# EAGLE design main-robot (EAGLE 9.5.2)

## Sheet 1 of 6: POWER SUPPLY
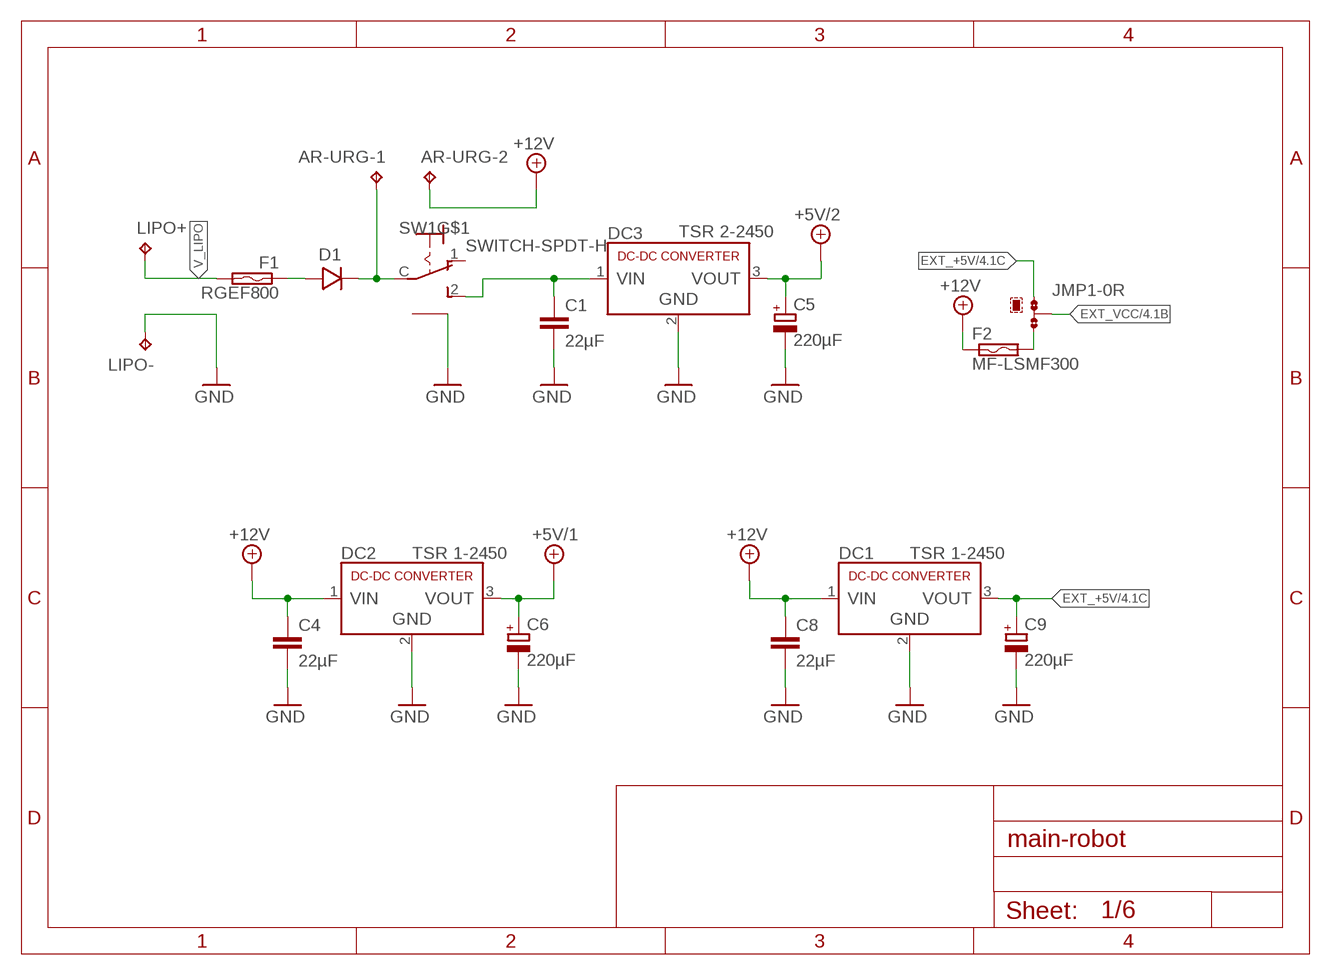
[diagram p0: schematic, sheet 1]

### Parts
AR-URG-1  TPPAD1-20Y  [P1-20Y]
AR-URG-2  TPPAD1-20Y  [P1-20Y]
C1  22µF  C-EUC0805  [C0805]
C4  22µF  C-EUC0805  [C0805]
C5  220µF  CPOL-EUD  [PANASONIC_D]
C6  220µF  CPOL-EUD  [PANASONIC_D]
C8  22µF  C-EUC0805  [C0805]
C9  220µF  CPOL-EUD  [PANASONIC_D]
D1  DIODE_S15P45  [TO-277A]
DC1  TSR 1-2450  TSR24501  [TSR1]
DC2  TSR 1-2450  TSR24501  [TSR1]
DC3  TSR 2-2450  TSR24502  [TSR2]
F1  RGEF800  [5MM]
F2  MF-LSMF300  [MF-LSMF300]
JMP1  0R-JUMPA  [A0R-JMP]
LIPO+  TPPAD1-20Y  [P1-20Y]
LIPO-  TPPAD1-20Y  [P1-20Y]
SW1  SWITCH-SPDT-H  [SWITCH_SPDT_H]

### Nets
+5V/1: C6.+ DC2.3(VOUT) ; also sheet 2,4,5
+5V/2: C5.+ DC3.3(VOUT) ; also sheet 3
+12V: AR-URG-2.TP C4.1 C8.1 DC1.1(VIN) DC2.1(VIN) F2.1 ; also sheet 4,5
EXT_+5V: C9.+ DC1.3(VOUT) JMP1.1 ; also sheet 4,6
EXT_VCC: JMP1.2 ; also sheet 4
GND: C1.2 C4.2 C5.- C6.- C8.2 C9.- DC1.2(GND) DC2.2(GND) DC3.2(GND) LIPO-.TP SW1.CASE1(GND) SW1.CASE2(GND) ; also sheet 2,3,4,5,6
N$1: C1.1 DC3.1(VIN) SW1.2
N$2: D1.+1(+) D1.+2(+) F1.P$1
N$11: AR-URG-1.TP D1.- SW1.C
N$15: F2.2 JMP1.3
V_LIPO: F1.P$2 LIPO+.TP
Unconnected: SW1.1

## Sheet 2 of 6: TEENSY
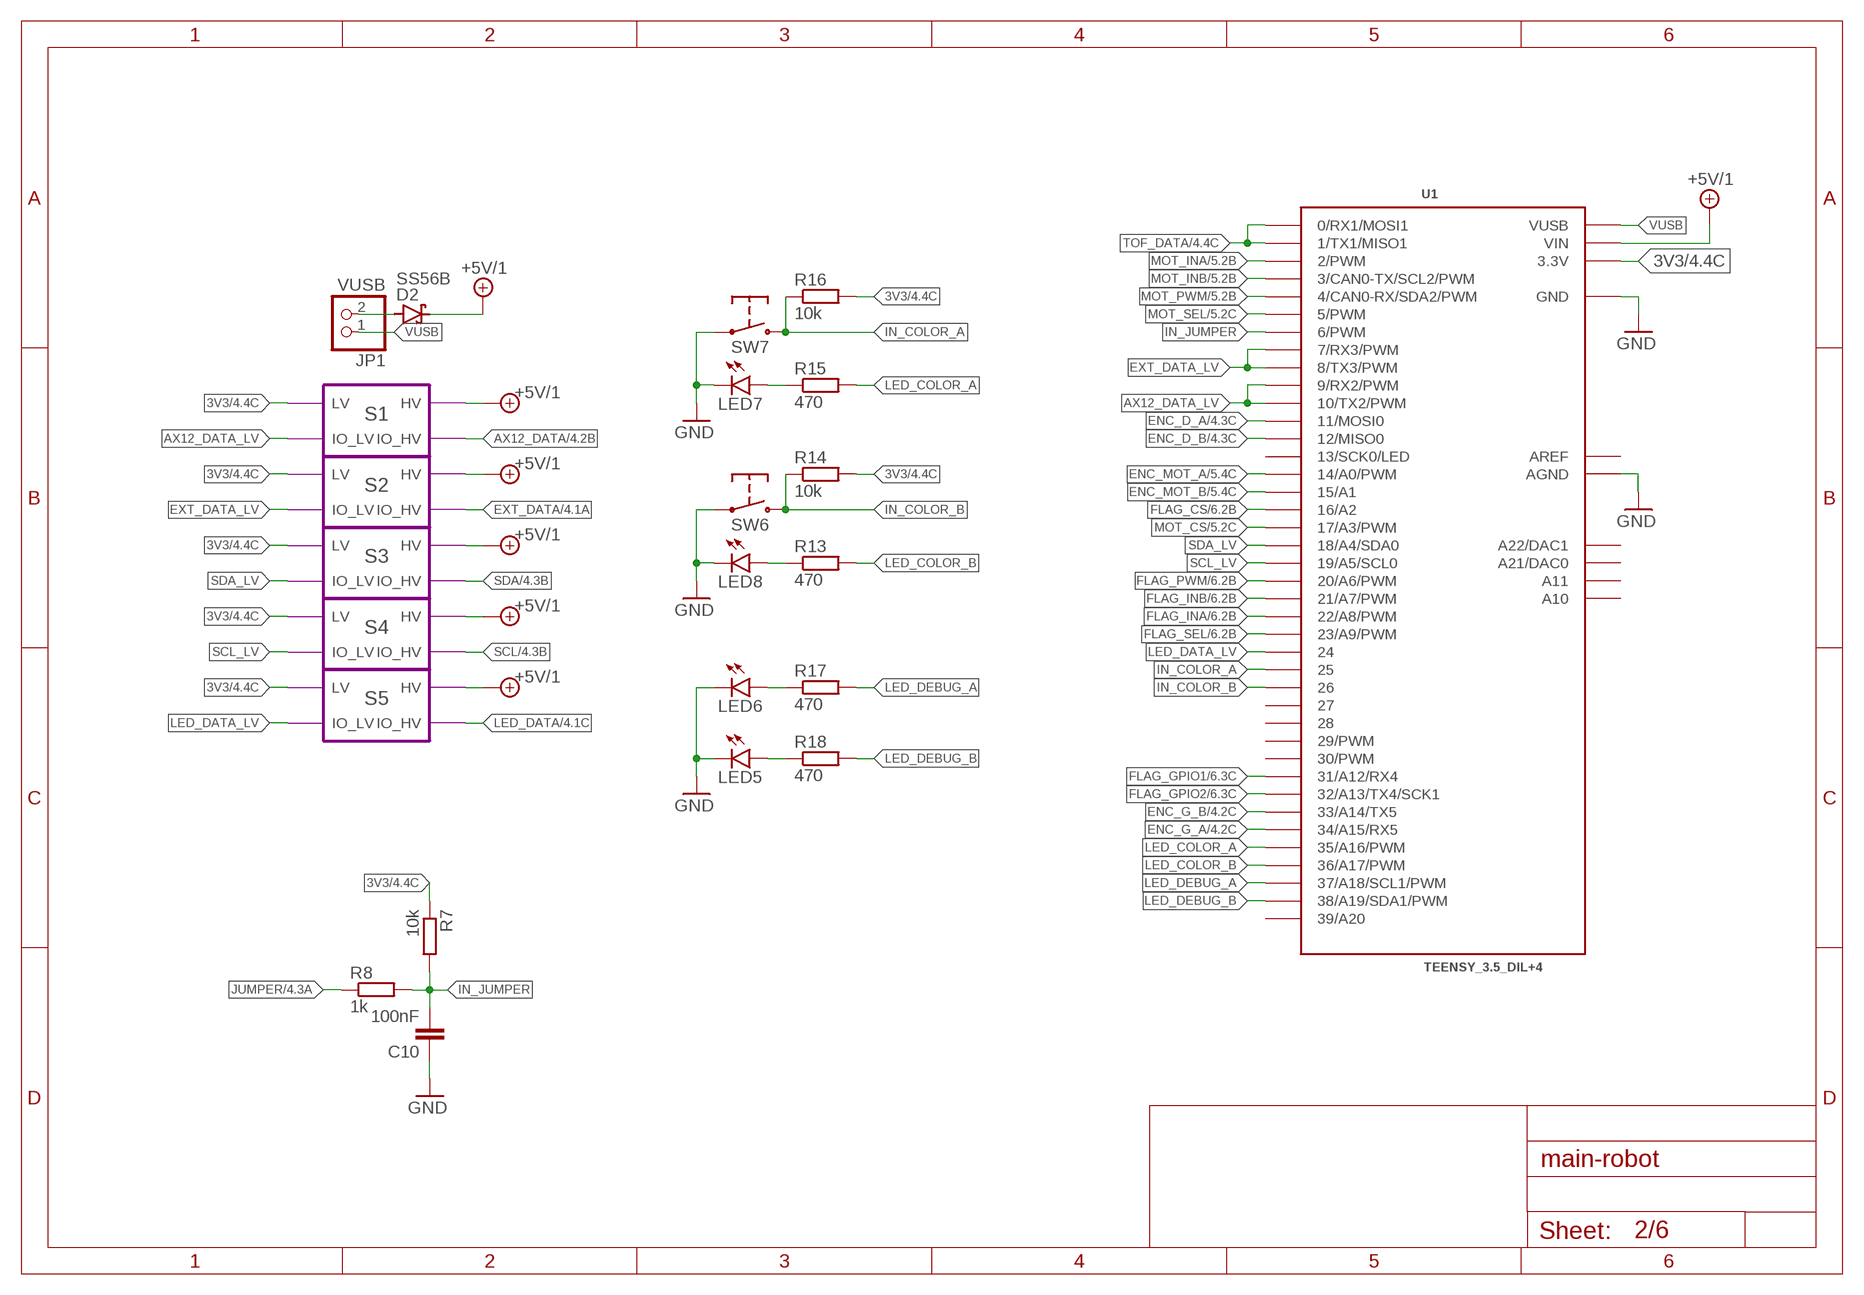
[diagram p1: schematic, sheet 2]

### Parts
C10  100nF  C-EUC0805  [C0805]
D2  SS56B  SCHOTTKY-DIODESMD  [SMB]
JP1  VUSB  PINHD-1X2  [1X02]
LED5  LEDSMT1206  [1206]
LED6  LEDSMT1206  [1206]
LED7  LEDSMT1206  [1206]
LED8  LEDSMT1206  [1206]
R7  10k  R-EU_R0805  [R0805]
R8  1k  R-EU_R0805  [R0805]
R13  470  R-EU_R0805  [R0805]
R14  10k  R-EU_R0805  [R0805]
R15  470  R-EU_R0805  [R0805]
R16  10k  R-EU_R0805  [R0805]
R17  470  R-EU_R0805  [R0805]
R18  470  R-EU_R0805  [R0805]
SW6  PUSH-BUTTON436331045822  [436331045822]
SW7  PUSH-BUTTON436331045822  [436331045822]
U1  TEENSY_3.5_DIL+4  [TEENSY_3.5_DIL+4]

### Module instances
S1 = LEVEL_SHIFTER
S2 = LEVEL_SHIFTER
S3 = LEVEL_SHIFTER
S4 = LEVEL_SHIFTER
S5 = LEVEL_SHIFTER

### Nets
3V3: R7.1 R14.2 R16.2 U1.3.3V U1.3.3V3(3.3V) ; port S1.LV S2.LV S3.LV S4.LV S5.LV ; also sheet 4
+5V/1: D2.C U1.VIN ; port S1.HV S2.HV S3.HV S4.HV S5.HV ; also sheet 1,4,5
AX12_DATA: port S1.IO_HV ; also sheet 4
AX12_DATA_LV: U1.9(9/RX2/PWM) U1.10(10/TX2/PWM) ; port S1.IO_LV
ENC_D_A: U1.11(11/MOSI0) ; also sheet 4
ENC_D_B: U1.12(12/MISO0) ; also sheet 4
ENC_G_A: U1.34/A15(34/A15/RX5) ; also sheet 4
ENC_G_B: U1.33/A14(33/A14/TX5) ; also sheet 4
ENC_MOT_A: U1.14/A0(14/A0/PWM) ; also sheet 5
ENC_MOT_B: U1.15/A1 ; also sheet 5
EXT_DATA: port S2.IO_HV ; also sheet 4
EXT_DATA_LV: U1.7(7/RX3/PWM) U1.8(8/TX3/PWM) ; port S2.IO_LV
FLAG_CS: U1.16/A2 ; also sheet 6
FLAG_GPIO1: U1.31/A12(31/A12/RX4) ; also sheet 6
FLAG_GPIO2: U1.32/A13(32/A13/TX4/SCK1) ; also sheet 6
FLAG_INA: U1.22/A8(22/A8/PWM) ; also sheet 6
FLAG_INB: U1.21/A7(21/A7/PWM) ; also sheet 6
FLAG_PWM: U1.20/A6(20/A6/PWM) ; also sheet 6
FLAG_SEL: U1.23/A9(23/A9/PWM) ; also sheet 6
GND: C10.1 LED5.C LED6.C LED7.C LED8.C SW6.1 SW6.3 SW7.1 SW7.3 U1.AGND U1.GND U1.GND1(GND) ; also sheet 1,3,4,5,6
IN_COLOR_A: R16.1 SW7.2 SW7.4 U1.25
IN_COLOR_B: R14.1 SW6.2 SW6.4 U1.26
IN_JUMPER: C10.2 R7.2 R8.2 U1.6(6/PWM)
JUMPER: R8.1 ; also sheet 4
LED_COLOR_A: R15.2 U1.35/A16(35/A16/PWM)
LED_COLOR_B: R13.2 U1.36/A17(36/A17/PWM)
LED_DATA: port S5.IO_HV ; also sheet 4
LED_DATA_LV: U1.24 ; port S5.IO_LV
LED_DEBUG_A: R17.2 U1.37/A18(37/A18/SCL1/PWM)
LED_DEBUG_B: R18.2 U1.38/A19(38/A19/SDA1/PWM)
MOT_CS: U1.17/A3(17/A3/PWM) ; also sheet 5
MOT_INA: U1.2(2/PWM) ; also sheet 5
MOT_INB: U1.3(3/CAN0-TX/SCL2/PWM) ; also sheet 5
MOT_PWM: U1.4(4/CAN0-RX/SDA2/PWM) ; also sheet 5
MOT_SEL: U1.5(5/PWM) ; also sheet 5
N$10: LED8.A R13.1
N$12: D2.A JP1.2
N$19: LED7.A R15.1
N$20: LED5.A R18.1
N$21: LED6.A R17.1
SCL: port S4.IO_HV ; also sheet 4
SCL_LV: U1.19/A5(19/A5/SCL0) ; port S4.IO_LV
SDA: port S3.IO_HV ; also sheet 4
SDA_LV: U1.18/A4(18/A4/SDA0) ; port S3.IO_LV
TOF_DATA: U1.0(0/RX1/MOSI1) U1.1(1/TX1/MISO1) ; also sheet 4
VUSB: JP1.1 U1.VUSB
Unconnected: U1.13(13/SCK0/LED) U1.27 U1.28 U1.29(29/PWM) U1.30(30/PWM) U1.39/A20 U1.A10 U1.A11 U1.A21(A21/DAC0) U1.A22(A22/DAC1)

## Sheet 3 of 6: RASPBERRY PI
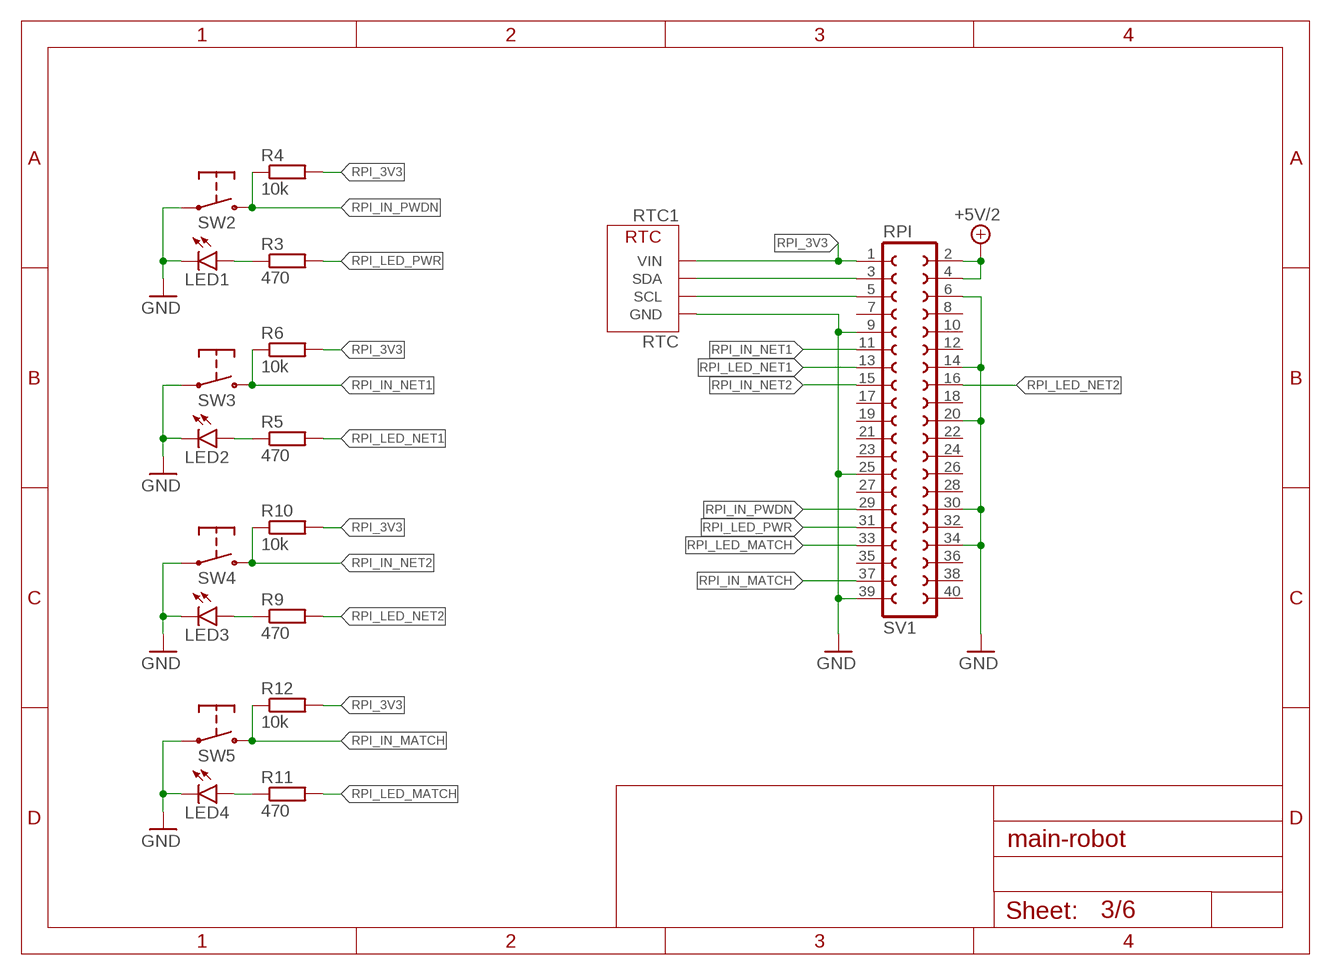
[diagram p2: schematic, sheet 3]

### Parts
LED1  LEDSMT1206  [1206]
LED2  LEDSMT1206  [1206]
LED3  LEDSMT1206  [1206]
LED4  LEDSMT1206  [1206]
R3  470  R-EU_R0805  [R0805]
R4  10k  R-EU_R0805  [R0805]
R5  470  R-EU_R0805  [R0805]
R6  10k  R-EU_R0805  [R0805]
R9  470  R-EU_R0805  [R0805]
R10  10k  R-EU_R0805  [R0805]
R11  470  R-EU_R0805  [R0805]
R12  10k  R-EU_R0805  [R0805]
RTC1  RTC  [RTC]
SV1  RPI  FE20-2  [FE20-2]
SW2  PUSH-BUTTON436331045822  [436331045822]
SW3  PUSH-BUTTON  [PUSH-BUTTON]
SW4  PUSH-BUTTON  [PUSH-BUTTON]
SW5  PUSH-BUTTON436331045822  [436331045822]

### Nets
+5V/2: SV1.2 SV1.4 ; also sheet 1
GND: LED1.C LED2.C LED3.C LED4.C RTC1.GND SV1.6 SV1.9 SV1.14 SV1.20 SV1.25 SV1.30 SV1.34 SV1.39 SW2.1 SW2.3 SW3.1 SW3.2 SW4.1 SW4.2 SW5.1 SW5.3 ; also sheet 1,2,4,5,6
N$9: LED1.A R3.1
N$13: RTC1.SDA SV1.3
N$14: RTC1.SCL SV1.5
N$16: LED2.A R5.1
N$17: LED3.A R9.1
N$18: LED4.A R11.1
RPI_3V3: R4.2 R6.2 R10.2 R12.2 RTC1.VIN SV1.1
RPI_IN_MATCH: R12.1 SV1.37 SW5.2 SW5.4
RPI_IN_NET1: R6.1 SV1.11 SW3.3 SW3.4
RPI_IN_NET2: R10.1 SV1.15 SW4.3 SW4.4
RPI_IN_PWDN: R4.1 SV1.29 SW2.2 SW2.4
RPI_LED_MATCH: R11.2 SV1.33
RPI_LED_NET1: R5.2 SV1.13
RPI_LED_NET2: R9.2 SV1.16
RPI_LED_PWR: R3.2 SV1.31
Unconnected: SV1.7 SV1.8 SV1.10 SV1.12 SV1.17 SV1.18 SV1.19 SV1.21 SV1.22 SV1.23 SV1.24 SV1.26 SV1.27 SV1.28 SV1.32 SV1.35 SV1.36 SV1.38 SV1.40

## Sheet 4 of 6: CONNECTORS
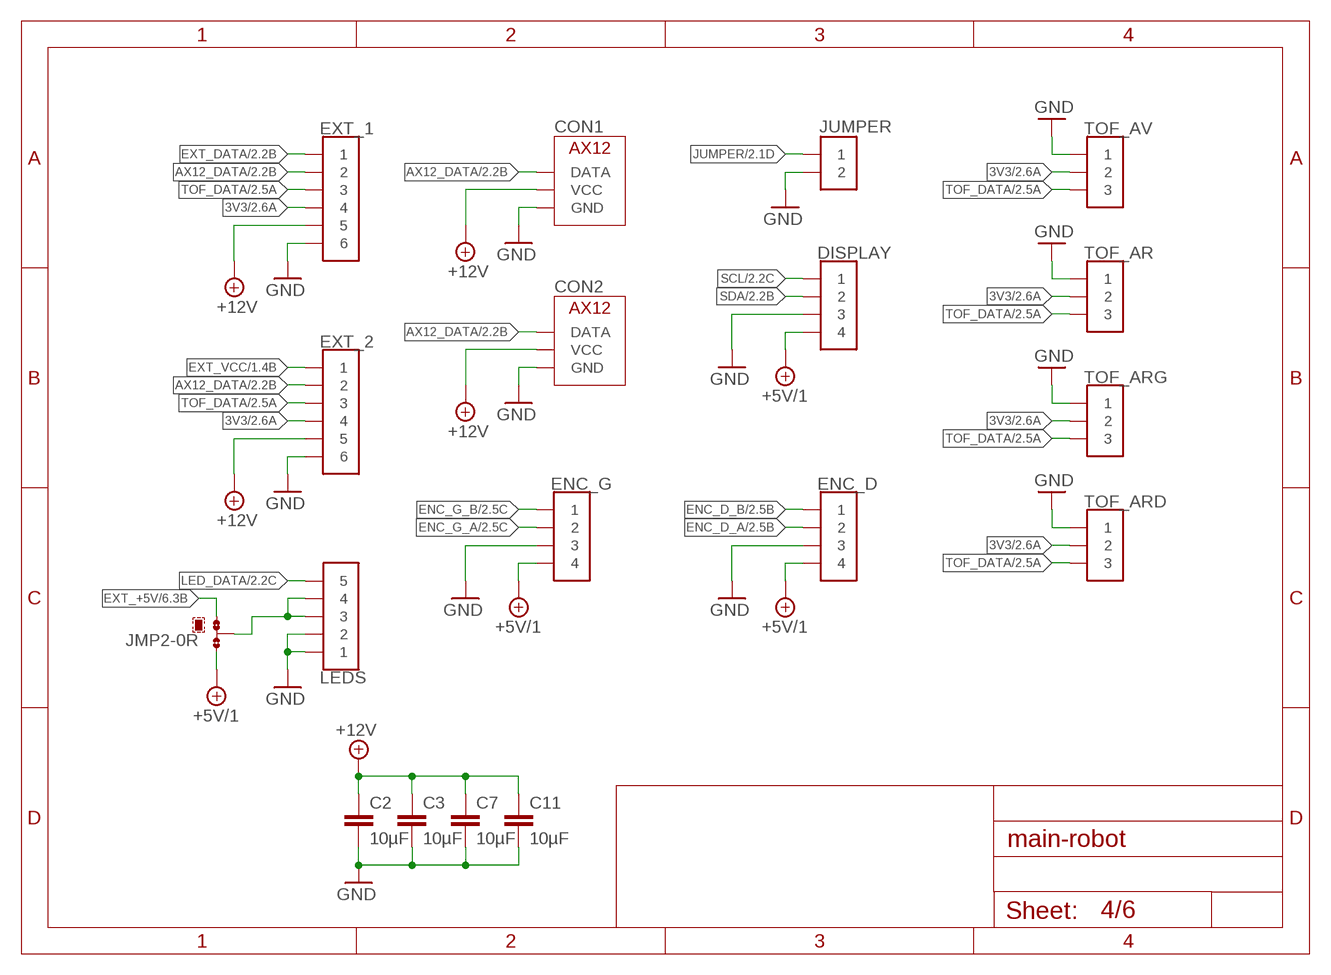
[diagram p3: schematic, sheet 4]

### Parts
C2  10µF  C-EUC0805  [C0805]
C3  10µF  C-EUC0805  [C0805]
C7  10µF  C-EUC0805  [C0805]
C11  10µF  C-EUC0805  [C0805]
CON1  AX12  [5267-03A]
CON2  AX12  [5267-03A]
DISPLAY  JST-04TOP  [BM04B-GHS]
ENC_D  JST-04TOP  [BM04B-GHS]
ENC_G  JST-04TOP  [BM04B-GHS]
EXT_1  JST-06SIDE  [SM06B-GHS]
EXT_2  JST-06TOP  [BM06B-GHS]
JMP2  0R-JUMPA  [A0R-JMP]
JUMPER  JST-02SIDE  [SM02B-GHS]
LEDS  JST-05SIDE  [SM05B-GHS]
TOF_AR  JST-03SIDE  [SM03B-GHS]
TOF_ARD  JST-03TOP  [BM03B-GHS]
TOF_ARG  JST-03TOP  [BM03B-GHS]
TOF_AV  JST-03TOP  [BM03B-GHS]

### Nets
3V3: EXT_1.4 EXT_2.4 TOF_AR.2 TOF_ARD.2 TOF_ARG.2 TOF_AV.2 ; also sheet 2
+5V/1: DISPLAY.4 ENC_D.4 ENC_G.4 JMP2.3 ; also sheet 1,2,5
+12V: C2.1 C3.1 C7.1 C11.1 CON1.2(VCC) CON2.2(VCC) EXT_1.5 EXT_2.5 ; also sheet 1,5
AX12_DATA: CON1.1(DATA) CON2.1(DATA) EXT_1.2 EXT_2.2 ; also sheet 2
ENC_D_A: ENC_D.2 ; also sheet 2
ENC_D_B: ENC_D.1 ; also sheet 2
ENC_G_A: ENC_G.2 ; also sheet 2
ENC_G_B: ENC_G.1 ; also sheet 2
EXT_+5V: JMP2.1 ; also sheet 1,6
EXT_DATA: EXT_1.1 ; also sheet 2
EXT_VCC: EXT_2.1 ; also sheet 1
GND: C2.2 C3.2 C7.2 C11.2 CON1.3(GND) CON2.3(GND) DISPLAY.3 ENC_D.3 ENC_G.3 EXT_1.6 EXT_2.6 JUMPER.2 LEDS.1 LEDS.2 TOF_AR.1 TOF_ARD.1 TOF_ARG.1 TOF_AV.1 ; also sheet 1,2,3,5,6
JUMPER: JUMPER.1 ; also sheet 2
LED_DATA: LEDS.5 ; also sheet 2
N$22: JMP2.2 LEDS.3 LEDS.4
SCL: DISPLAY.1 ; also sheet 2
SDA: DISPLAY.2 ; also sheet 2
TOF_DATA: EXT_1.3 EXT_2.3 TOF_AR.3 TOF_ARD.3 TOF_ARG.3 TOF_AV.3 ; also sheet 2

## Sheet 5 of 6: MOTOR
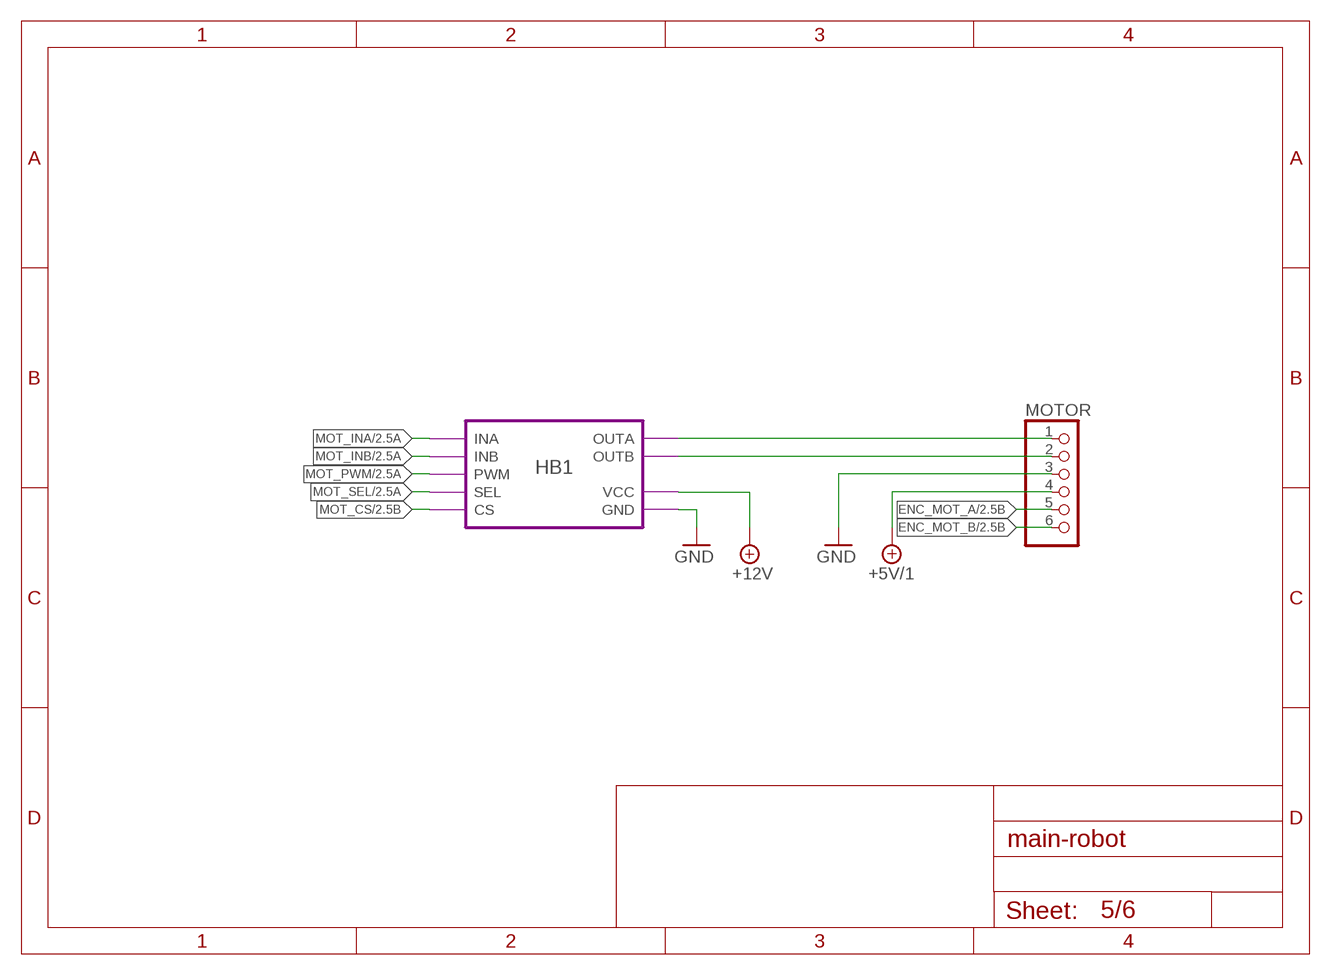
[diagram p4: schematic, sheet 5]

### Parts
MOTOR  PINHD-1X6  [1X06]

### Module instances
HB1 = H-BRIDGE

### Nets
+5V/1: MOTOR.4 ; also sheet 1,2,4
+12V: port HB1.VCC ; also sheet 1,4
ENC_MOT_A: MOTOR.5 ; also sheet 2
ENC_MOT_B: MOTOR.6 ; also sheet 2
GND: MOTOR.3 ; port HB1.GND ; also sheet 1,2,3,4,6
MOT_CS: port HB1.CS ; also sheet 2
MOT_INA: port HB1.INA ; also sheet 2
MOT_INB: port HB1.INB ; also sheet 2
MOT_PWM: port HB1.PWM ; also sheet 2
MOT_SEL: port HB1.SEL ; also sheet 2
N$3: MOTOR.1 ; port HB1.OUTA
N$4: MOTOR.2 ; port HB1.OUTB

## Sheet 6 of 6: FLAG
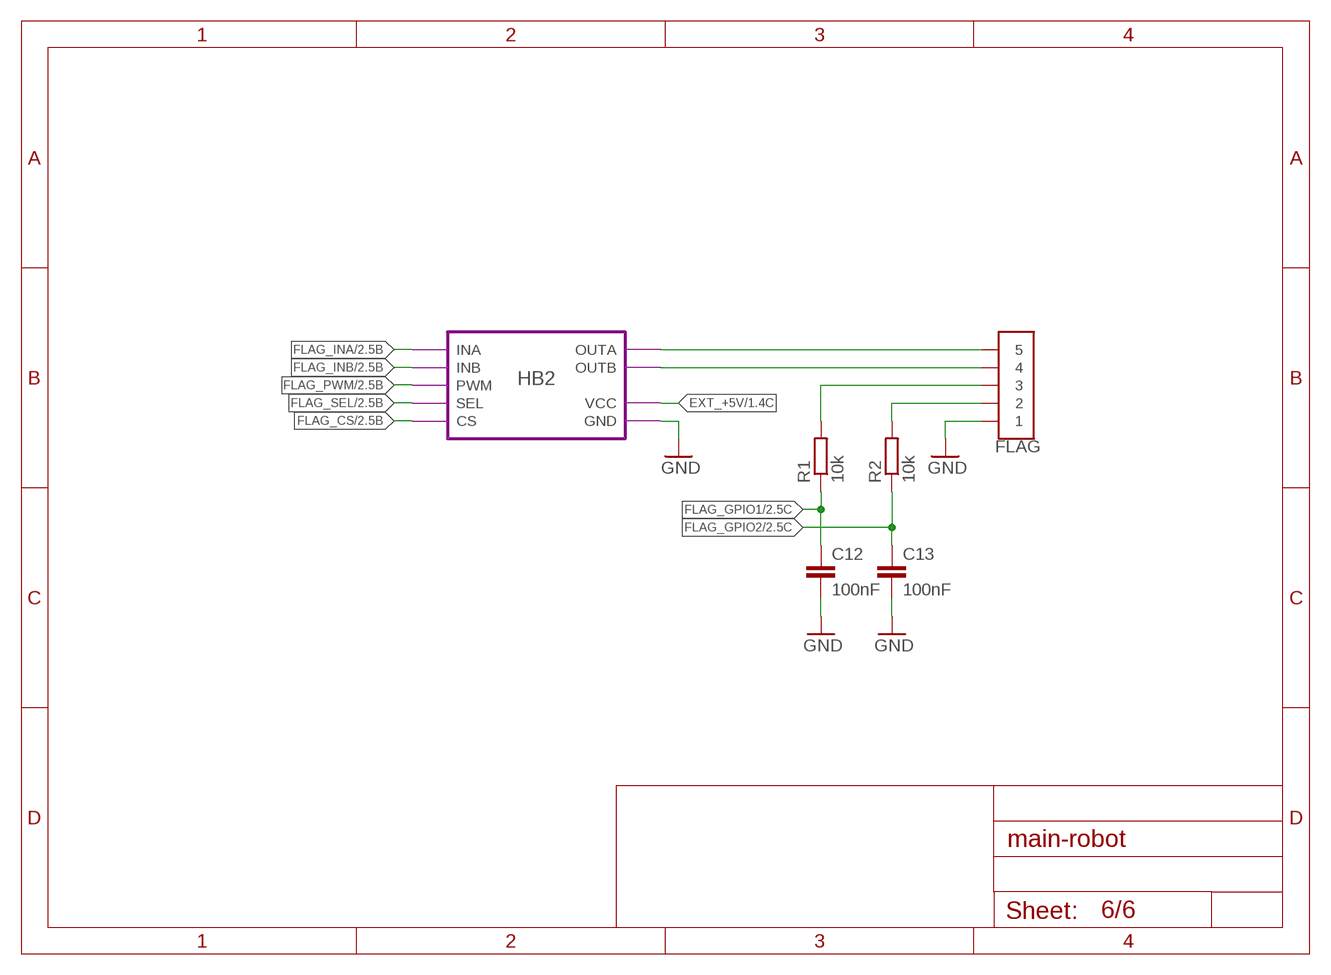
[diagram p5: schematic, sheet 6]

### Parts
C12  100nF  C-EUC0805  [C0805]
C13  100nF  C-EUC0805  [C0805]
FLAG  JST-05TOP  [BM05B-GHS]
R1  10k  R-EU_R0805  [R0805]
R2  10k  R-EU_R0805  [R0805]

### Module instances
HB2 = H-BRIDGE

### Nets
EXT_+5V: port HB2.VCC ; also sheet 1,4
FLAG_CS: port HB2.CS ; also sheet 2
FLAG_GPIO1: C12.1 R1.1 ; also sheet 2
FLAG_GPIO2: C13.1 R2.1 ; also sheet 2
FLAG_INA: port HB2.INA ; also sheet 2
FLAG_INB: port HB2.INB ; also sheet 2
FLAG_PWM: port HB2.PWM ; also sheet 2
FLAG_SEL: port HB2.SEL ; also sheet 2
GND: C12.2 C13.2 FLAG.1 ; port HB2.GND ; also sheet 1,2,3,4,5
N$5: FLAG.5 ; port HB2.OUTA
N$6: FLAG.4 ; port HB2.OUTB
N$7: FLAG.3 R1.2
N$8: FLAG.2 R2.2

## Power pins joined to a net without a drawn wire
AREF: U1.AREF

## Library data of the parts
AR-URG-1 AR-URG-2 LIPO+ LIPO- = testpad:TP: Test pad
C1-C4 C7 C8 C10-C13 = resistor:C-EU: CAPACITOR, European symbol
C5 = resistor:CPOL-EU: POLARIZED CAPACITOR, European symbol; REF_MOUSER: 667-EEE-FT1C221AP
C6 C9 = resistor:CPOL-EU: POLARIZED CAPACITOR, European symbol
CON1 CON2 = con-molex-dynamixel:AX12; MANUFACTURER: Molex; REF: 5267-03A; REF-STD: 22-03-5035; REF-SW: 99-99-0987
D1 = diode_schottky:DIODE_S15P45; RS: 917-9118
D2 = diode:SCHOTTKY-DIODE: Schottky Diode; RS: 917-9221
DC1 DC2 = traco-power:TSR; MANUFACTURER: TRACO POWER; OUTPUT_VOLTAGE: 5; REF: TSR 1-2450; RS: 666-4379
DC3 = traco-power:TSR; MANUFACTURER: TRACO POWER; OUTPUT_VOLTAGE: 5; REF: TSR 2-2450; RS: 906-8487
DISPLAY ENC_D ENC_G = con-jst-gh:JST-04
EXT_1 EXT_2 = con-jst-gh:JST-06
F1 = polyswitch:RGEF800; RS: 517-6966
F2 = polyswitch:MF-LSMF300: PolySwitch (TM) Resettable Device Source: Data sheet <http://www.farnell.com/datasheets/13482.pdf>
FLAG LEDS = con-jst-gh:JST-05
JMP1 JMP2 = jump-0r-smd:0R-JUMP: SMD 0R 0805 Jumper
JP1 = pinhead:PINHD-1X2: PIN HEADER
JUMPER = con-jst-gh:JST-02
LED1-LED8 = led:LED: LED OSRAM: - CHIPLED LG R971, LG N971, LY N971, LG Q971, LY Q971, LO R971, LY R971 LH N974, LH R974 LS Q976, LO Q976, LY Q976 LO Q996 - Hyper CHIPLED LW Q18S LB Q993, LB Q99A, LB R99A - SideLED LS A670, LO A670, LY A670, LG A670, LP A670 LB A673, LV A673, LT A673, LW A673 LH A674 LY A675 LS A676, LA A676, LO A676, LY A676, LW A676 LS A679, LY A679, LG A679 - Hyper Micro SIDELED® LS Y876, LA Y876, LO Y876, LY Y876 LT Y87S - SmartLED LW L88C, LW L88S LB L89C, LB L89S, LG L890 LS L89K, LO L89K, LY L89K LS L896, LA L896, LO L896, LY L896 - TOPLED LS T670, LO T670, LY T670, LG T670, LP T670 LSG T670, LSP T670, LSY T670, LOP T670, LYG T670 LG T671, LOG T671, LSG T671 LB T673, LV T673, LT T673, LW T673 LH T674 LS T676, LA T676, LO T676, LY T676, LB T676, LH T676, LSB T676, LW T676 LB T67C, LV T67C, LT T67C, LS T67K, LO T67K, LY T67K, LW E67C LS E67B, LA E67B, LO E67B, LY E67B, LB E67C, LV E67C, LT E67C LW T67C LS T679, LY T679, LG T679 LS T770, LO T770, LY T770, LG T770, LP T770 LB T773, LV T773, LT T773, LW T773 LH T774 LS E675, LA E675, LY E675, LS T675 LS T776, LA T776, LO T776, LY T776, LB T776 LHGB T686 LT T68C, LB T68C - Hyper Mini TOPLED® LB M676 - Mini TOPLED Santana® LG M470 LS M47K, LO M47K, LY M47K Source: http://www.osram.convergy.de LUXEON: - LUMILED® LXK2-PW12-R00, LXK2-PW12-S00, LXK2-PW14-U00, LXK2-PW14-V00 LXK2-PM12-R00, LXK2-PM12-S00, LXK2-PM14-U00 LXK2-PE12-Q00, LXK2-PE12-R00, LXK2-PE12-S00, LXK2-PE14-T00, LXK2-PE14-U00 LXK2-PB12-K00, LXK2-PB12-L00, LXK2-PB12-M00, LXK2-PB14-N00, LXK2-PB14-P00, LXK2-PB14-Q00 LXK2-PR12-L00, LXK2-PR12-M00, LXK2-PR14-Q00, LXK2-PR14-R00 LXK2-PD12-Q00, LXK2-PD12-R00, LXK2-PD12-S00 LXK2-PH12-R00, LXK2-PH12-S00 LXK2-PL12-P00, LXK2-PL12-Q00, LXK2-PL12-R00 Source: www.luxeon.com KINGBRIGHT: KA-3528ASYC Source: www.kingbright.com
MOTOR = pinhead:PINHD-1X6: PIN HEADER
R1-R18 = resistor:R-EU_: RESISTOR, European symbol
RTC1 = rtc-raspberry-pi:RTC
SV1 = con-raspberry-pi:FE20-2: FEMALE HEADER; MANUFACTURER: Samtec; MOUSER: 200-ESW12048GD; REF: ESW-120-48-G-D
SW1 = switch-rs-pro:SWITCH-SPDT-H; REF-FAB: 5MS1S102AM6QES; REF-RS: 734-7296
SW2 SW5-SW7 = push-button:PUSH-BUTTON; MANUFACTURER: Wurth Elektronik; REF: 436331045822
SW3 SW4 = push-button:PUSH-BUTTON; RS: 479-1491
TOF_AR TOF_ARD TOF_ARG TOF_AV = con-jst-gh:JST-03
U1 = teensy:TEENSY_3.5_DIL+4: DIL version of Teensy 3.5 plus the VUSB/A10/A11/AREF PINS

## Module LEVEL_SHIFTER
Ports: LV(io) IO_LV(io) HV(io) IO_HV(io)
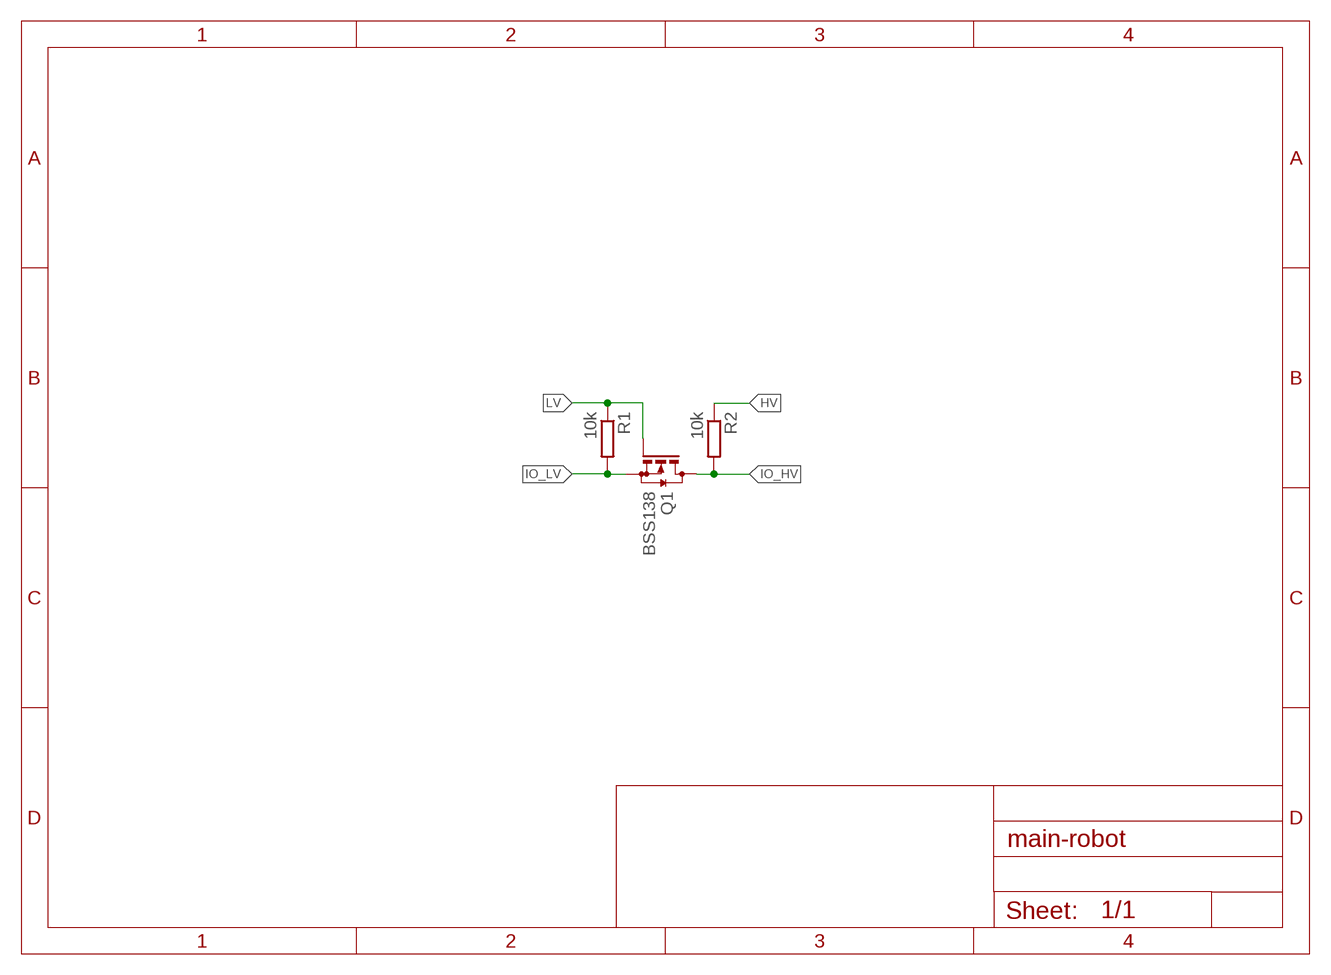
[diagram p6: schematic, module LEVEL_SHIFTER, sheet 1]

### Parts
Q1  BSS138  BSS123  [SOT23]
R1  10k  R-EU_R0805  [R0805]
R2  10k  R-EU_R0805  [R0805]

### Nets
HV: R2.1
IO_HV: Q1.3(D) R2.2
IO_LV: Q1.2(S) R1.2
LV: Q1.1(G) R1.1

### Library data of the parts
Q1 = transistor-small-signal:BSS123: N-CHANNEL MOS FET; RS: 669-7559
R1 R2 = resistor:R-EU_: RESISTOR, European symbol

## Module H-BRIDGE
Ports: GND(io) VCC(io) OUTA(io) OUTB(io) INA(io) INB(io) PWM(io) SEL(io) CS(io)
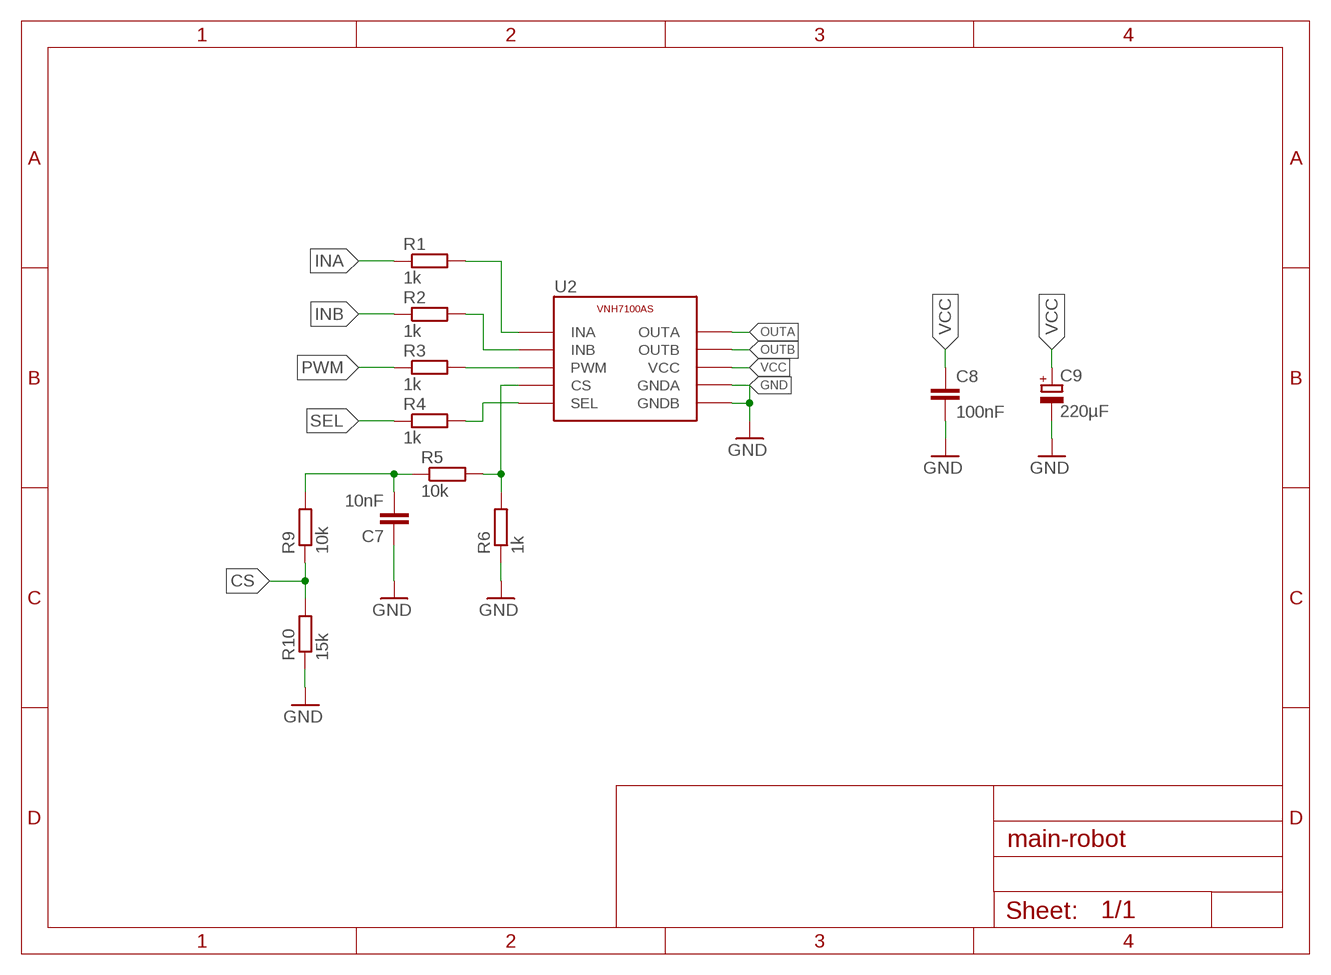
[diagram p7: schematic, module H-BRIDGE, sheet 1]

### Parts
C7  10nF  C-EUC0805  [C0805]
C8  100nF  C-EUC0805  [C0805]
C9  220µF  CPOL-EUD  [PANASONIC_D]
R1  1k  R-EU_R0805  [R0805]
R2  1k  R-EU_R0805  [R0805]
R3  1k  R-EU_R0805  [R0805]
R4  1k  R-EU_R0805  [R0805]
R5  10k  R-EU_R0805  [R0805]
R6  1k  R-EU_R0805  [R0805]
R9  10k  R-EU_R0805  [R0805]
R10  15k  R-EU_R0805  [R0805]
U2  VNH7100AS  [SOIC127P600X175-16M]

### Nets
CS: R9.1 R10.2
GND: C7.1 C8.2 C9.- R6.1 R10.1 U2.1(GNDA) U2.8(GNDB) U2.9(GNDB) U2.16(GNDA)
INA: R1.1
INB: R2.1
N$5: R3.2 U2.11(PWM)
N$6: R2.2 U2.6(INB)
N$7: R1.2 U2.3(INA)
N$8: R4.2 U2.14(SEL)
N$9: R5.2 R6.2 U2.13(CS)
N$13: C7.2 R5.1 R9.2
OUTA: U2.2(OUTA) U2.15(OUTA)
OUTB: U2.7(OUTB) U2.10(OUTB)
PWM: R3.1
SEL: R4.1
VCC: C8.1 C9.+ U2.4(VCC) U2.5(VCC) U2.12(VCC)

### Library data of the parts
C7 C8 = resistor:C-EU: CAPACITOR, European symbol
C9 = resistor:CPOL-EU: POLARIZED CAPACITOR, European symbol
R1-R6 R9 R10 = resistor:R-EU_: RESISTOR, European symbol
U2 = h-bridge:VNH7100AS

## Board
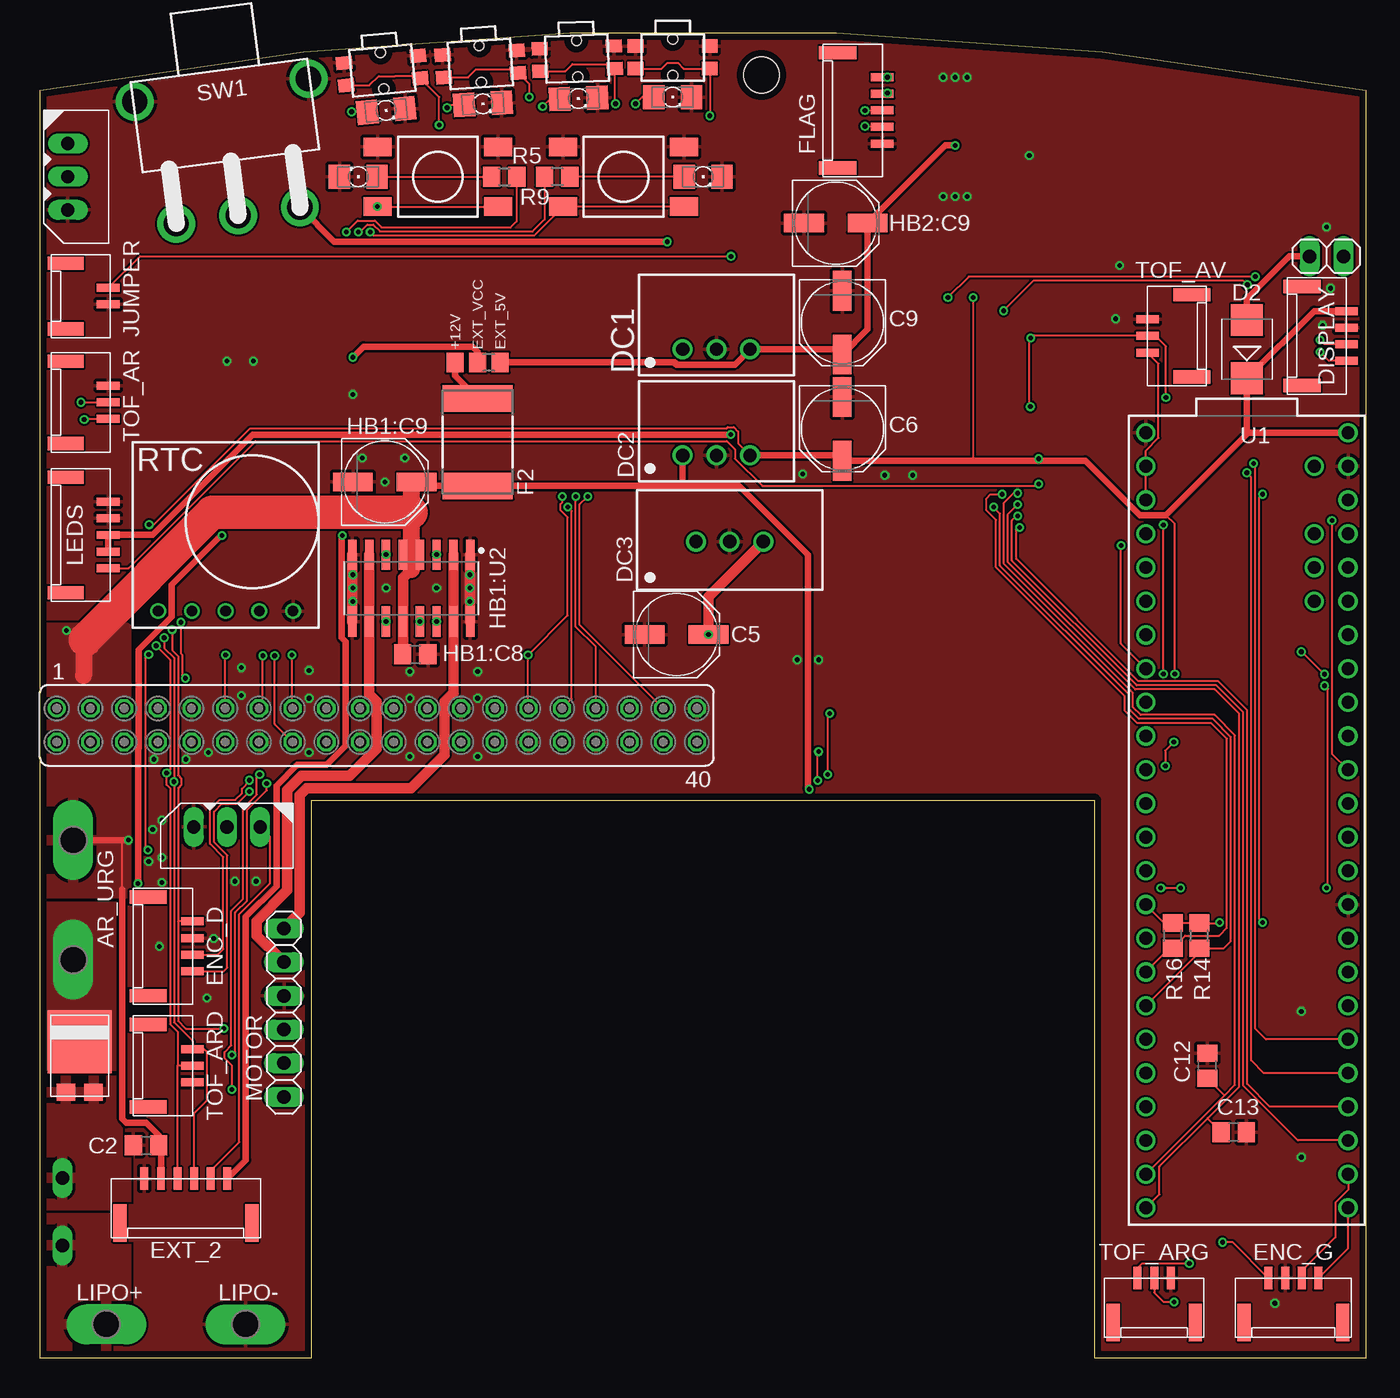
[diagram p8: board, top side]
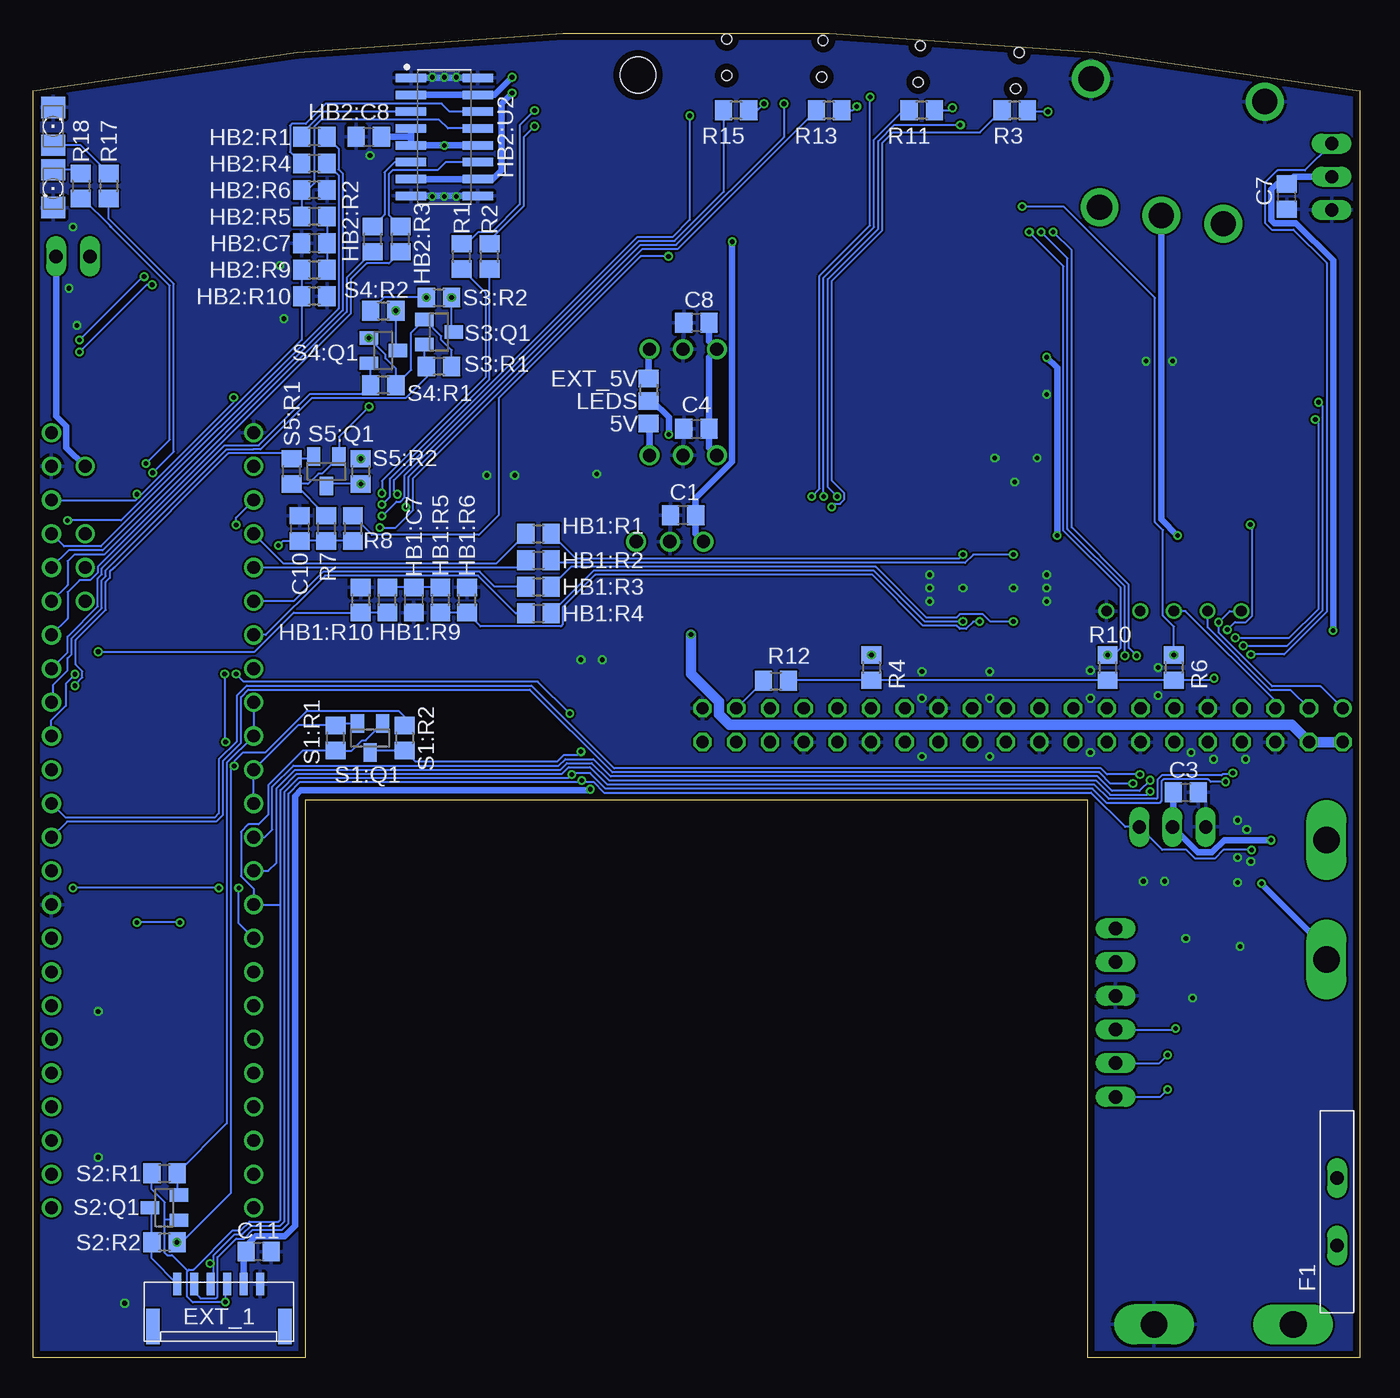
[diagram p9: board, bottom side, seen from below]

Size 100 x 99.82 mm. Coordinates in mm from the lower left corner, seen from the top.
Outline: 0,95.48 0,49.8 0,0 20.5,0 20.5,42 79.5,42 79.5,0 100,0 100,95.48 arc21 0,95.48
Copper layers (1*16): Top 0.035mm / dielectric 1.6mm / Bottom 0.035mm
Design rules "Elecrow_2-layer_PCB_eagle_rule *": minimum track width 6mil, minimum drill 12mil, track to track 6mil, track to pad 6mil, pad to pad 6mil, via to via 8mil, smd to smd 0mil, copper to edge 20mil, drill to drill 10mil, minimum pad ring 6mil, minimum via ring 6mil, stop-mask expansion 0mil, vias tented up to drill 100mil, thermal gap 10mil
Holes 2.7 mm at 54.4,96.67
tKeepout: area 51.4,93.7 to 57.4,99.7; 6 lines
bKeepout: area 51.4,93.7 to 57.4,99.7; 8 lines

### Footprints (pad centres in the part's own frame; a part is rotated, then mirrored left to right if it is on the bottom)
P1-20Y = drill 2.007 pad 2.54 long: TP 0,0
C0805 = smd 1.3 x 1.5: 1 -0.95,0; 2 0.95,0
PANASONIC_D = smd 3 x 1.4: + 2.4,0; - -2.4,0
5267-03A = drill 1 long: 1 2.5,0; 2 0,0; 3 -2.5,0
TO-277A = smd 1.4 x 1.27: +1 -1.04,-1; +2 1.04,-1 | smd 4.8 x 4.72: - 0,2.81
SMB = smd 2.4 x 2.4: A 2.2,0; C -2.2,0
TSR1 = drill 1: 1 -2.54,0; 2 0,0; 3 2.54,0
TSR2 = drill 1: 1 -2.54,0; 2 0,0; 3 2.54,0
BM04B-GHS = smd 0.6 x 1.7: 1 1.875,2.5; 2 0.625,2.5; 3 -0.625,2.5; 4 -1.875,2.5 | smd 1 x 2.8: CASE0 3.725,-0.85; CASE1 -3.725,-0.85
SM06B-GHS = smd 0.6 x 1.7: 1 -3.125,2.05; 2 -1.875,2.05; 3 -0.625,2.05; 4 0.625,2.05; 5 1.875,2.05; 6 3.125,2.05 | smd 1 x 2.7: CASE0 4.975,-1.15; CASE1 -4.975,-1.15
BM06B-GHS = smd 0.6 x 1.7: 1 3.125,2.5; 2 1.875,2.5; 3 0.625,2.5; 4 -0.625,2.5; 5 -1.875,2.5; 6 -3.125,2.5 | smd 1 x 2.8: CASE0 4.975,-0.85; CASE1 -4.975,-0.85
5MM = drill 1 long: P$1 -2.54,0; P$2 2.54,0
MF-LSMF300 = smd 2 x 5.3: 1 -3.3,0; 2 3.3,0
BM05B-GHS = smd 0.6 x 1.7: 1 2.5,2.5; 2 1.25,2.5; 3 0,2.5; 4 -1.25,2.5; 5 -2.5,2.5 | smd 1 x 2.8: CASE0 4.35,-0.85; CASE1 -4.35,-0.85
R0805 = smd 1.3 x 1.5: 1 -0.95,0; 2 0.95,0
SOIC127P600X175-16M = smd 2.268 x 0.639: 1 -2.523,4.445; 2 -2.523,3.175; 3 -2.523,1.905; 4 -2.523,0.635; 5 -2.523,-0.635; 6 -2.523,-1.905; 7 -2.523,-3.175; 8 -2.523,-4.445; 9 2.523,-4.445; 10 2.523,-3.175; 11 2.523,-1.905; 12 2.523,-0.635; 13 2.523,0.635; 14 2.523,1.905; 15 2.523,3.175; 16 2.523,4.445
A0R-JMP = smd 1.5 x 1.3: 1 0,1.7; 2 0,0; 3 0,-1.7
1X02 = drill 1.016 long: 1 -1.27,0; 2 1.27,0
SM02B-GHS = smd 0.6 x 1.7: 1 -0.625,2.05; 2 0.625,2.05 | smd 1 x 2.7: CASE0 2.475,-1.15; CASE1 -2.475,-1.15
1206 = smd 1.6 x 1.803: A -1.422,0; C 1.422,0
SM05B-GHS = smd 0.6 x 1.7: 1 -2.5,2.05; 2 -1.25,2.05; 3 0,2.05; 4 1.25,2.05; 5 2.5,2.05 | smd 1 x 2.7: CASE0 4.35,-1.15; CASE1 -4.35,-1.15
1X06 = drill 1.016 long: 1 -6.35,0; 2 -3.81,0; 3 -1.27,0; 4 1.27,0; 5 3.81,0; 6 6.35,0
RTC = drill 0.8: GND -5.08,-1.27; NC -2.54,-1.27; SCL 0,-1.27; SDA 2.54,-1.27; VIN 5.08,-1.27
SOT23 = smd 1 x 1.4: 1 -0.95,-1.1; 2 0.95,-1.1; 3 0,1.1
FE20-2 = drill 0.914: 1 -24.13,1.27 | drill 0.914 octagon: 2 -24.13,-1.27; 3 -21.59,1.27; 4 -21.59,-1.27; 5 -19.05,1.27; 6 -19.05,-1.27; 7 -16.51,1.27; 8 -16.51,-1.27; 9 -13.97,1.27; 10 -13.97,-1.27; 11 -11.43,1.27; 12 -11.43,-1.27; 13 -8.89,1.27; 14 -8.89,-1.27; 15 -6.35,1.27; 16 -6.35,-1.27; 17 -3.81,1.27; 18 -3.81,-1.27; 19 -1.27,1.27; 20 -1.27,-1.27; 21 1.27,1.27; 22 1.27,-1.27; 23 3.81,1.27; 24 3.81,-1.27; 25 6.35,1.27; 26 6.35,-1.27; 27 8.89,1.27; 28 8.89,-1.27; 29 11.43,1.27; 30 11.43,-1.27; 31 13.97,1.27; 32 13.97,-1.27; 33 16.51,1.27; 34 16.51,-1.27; 35 19.05,1.27; 36 19.05,-1.27; 37 21.59,1.27; 38 21.59,-1.27; 39 24.13,1.27; 40 24.13,-1.27
SWITCH_SPDT_H = drill 1.9: 1 -4.7,-4.16; 2 4.7,-4.16; C 0,-4.16; CASE1 -6.605,5.37; CASE2 6.605,5.37
436331045822 = smd 1.2 x 1: 1 2.8,0.85; 2 2.8,-0.85; 3 -2.8,0.85; 4 -2.8,-0.85 | hole 0.75: 0,1.375; 0,-1.375
PUSH-BUTTON = smd 1.4 x 2.1: 1 2.25,4.55; 2 2.25,-4.55; 3 -2.25,4.55; 4 -2.25,-4.55
SM03B-GHS = smd 0.6 x 1.7: 1 -1.25,2.05; 2 0,2.05; 3 1.25,2.05 | smd 1 x 2.7: CASE0 3.1,-1.15; CASE1 -3.1,-1.15
BM03B-GHS = smd 0.6 x 1.7: 1 1.25,2.5; 2 0,2.5; 3 -1.25,2.5 | smd 1 x 2.8: CASE0 3.1,-0.85; CASE1 -3.1,-0.85
TEENSY_3.5_DIL+4 = drill 0.965: 0 -7.62,26.67; 1 -7.62,24.13; 2 -7.62,21.59; 3 -7.62,19.05; 3.3V 7.62,24.13; 3.3V3 -7.62,-6.35; 4 -7.62,16.51; 5 -7.62,13.97; 6 -7.62,11.43; 7 -7.62,8.89; 8 -7.62,6.35; 9 -7.62,3.81; 10 -7.62,1.27; 11 -7.62,-1.27; 12 -7.62,-3.81; 13 7.62,-3.81; 14/A0 7.62,-1.27; 15/A1 7.62,1.27; 16/A2 7.62,3.81; 17/A3 7.62,6.35; 18/A4 7.62,8.89; 19/A5 7.62,11.43; 20/A6 7.62,13.97; 21/A7 7.62,16.51; 22/A8 7.62,19.05; 23/A9 7.62,21.59; 24 -7.62,-8.89; 25 -7.62,-11.43; 26 -7.62,-13.97; 27 -7.62,-16.51; 28 -7.62,-19.05; 29 -7.62,-21.59; 30 -7.62,-24.13; 31/A12 -7.62,-26.67; 32/A13 -7.62,-29.21; 33/A14 7.62,-29.21; 34/A15 7.62,-26.67; 35/A16 7.62,-24.13; 36/A17 7.62,-21.59; 37/A18 7.62,-19.05; 38/A19 7.62,-16.51; 39/A20 7.62,-13.97; A10 5.08,19.05; A11 5.08,16.51; A21 7.62,-11.43; A22 7.62,-8.89; AGND 7.62,26.67; AREF 5.08,21.59; GND -7.62,29.21; GND1 7.62,-6.35; VIN 7.62,29.21; VUSB 5.08,26.67

### Placement (x,y rotation side)
AR-URG-1  2.5,30 0 top
AR-URG-2  2.5,39 0 top
C1  51,63.5 180 bottom
C2  8,16 180 top
C3  13.1,42.6 0 bottom
C4  50,70 180 bottom
C5  48,54.5 0 top
C6  60.5,70 270 top
C7  5.5,87.5 270 bottom
C8  50,78 180 bottom
C9  60.5,78 270 top
C10  79.9,62.5 270 bottom
C11  83,8 0 bottom
C12  88,22 90 top
C13  90,17 0 top
CON1  14.1,40 0 top
CON2  2.1,89 90 top
D1  3,21 0 top
D2  91,76 90 top
DC1  51,76 0 top
DC2  51,68 0 top
DC3  52,61.5 0 top
DISPLAY  96,77 270 top
ENC_D  9,31 270 top
ENC_G  94.5,3.5 0 top
EXT_1  86,3.5 0 bottom
EXT_2  11,11 0 top
F1  1.7,11 270 bottom
F2  33,69 90 top
FLAG  61,94 270 top
HB1:C7  10nF  [C0805]  71.3,57.1 90 bottom
HB1:C8  100nF  [C0805]  28.3,53 0 top
HB1:C9  220µF  [PANASONIC_D]  26,66 0 top
HB1:R1  1k  [R0805]  61.9,62.1 0 bottom
HB1:R2  1k  [R0805]  61.9,60.1 0 bottom
HB1:R3  1k  [R0805]  61.9,58.1 0 bottom
HB1:R4  1k  [R0805]  61.9,56.1 0 bottom
HB1:R5  10k  [R0805]  69.3,57.1 270 bottom
HB1:R6  1k  [R0805]  67.3,57.1 270 bottom
HB1:R9  10k  [R0805]  73.3,57.1 90 bottom
HB1:R10  15k  [R0805]  75.3,57.1 270 bottom
HB1:U2  VNH7100AS  [SOIC127P600X175-16M]  28,58 270 top
HB2:C7  10nF  [C0805]  78.8,84 0 bottom
HB2:C8  100nF  [C0805]  74.7,92 180 bottom
HB2:C9  220µF  [PANASONIC_D]  60,85.5 0 top
HB2:R1  1k  [R0805]  78.8,92 180 bottom
HB2:R2  1k  [R0805]  74.4,84.3 90 bottom
HB2:R3  1k  [R0805]  72.3,84.3 90 bottom
HB2:R4  1k  [R0805]  78.8,90 180 bottom
HB2:R5  10k  [R0805]  78.8,86 180 bottom
HB2:R6  1k  [R0805]  78.8,88 180 bottom
HB2:R9  10k  [R0805]  78.8,82 0 bottom
HB2:R10  15k  [R0805]  78.8,80 180 bottom
HB2:U2  VNH7100AS  [SOIC127P600X175-16M]  69,92 0 bottom
JMP1  33,75 270 top
JMP2  53.6,72.1 0 bottom
JP1  97,83 180 top
JUMPER  3.1,80 270 top
LED1  26.1,94 5.5 top
LED2  24,89 180 top
LED3  50,89 0 top
LED4  33.4,94.5 3.5 top
LED5  98.5,88.1 270 bottom
LED6  98.5,92.8 90 bottom
LED7  47.7,95 0 top
LED8  40.6,94.9 2 top
LEDS  3.1,62 270 top
LIPO+  5,2.5 90 top
LIPO-  15.5,2.5 270 top
MOTOR  18.4,26 270 top
R1  67.7,83 90 bottom
R2  65.6,83 90 bottom
R3  26,94 180 bottom
R4  36.8,52 270 bottom
R5  35,89 0 top
R6  14,52 270 bottom
R7  77.9,62.5 270 bottom
R8  75.9,62.5 270 bottom
R9  39,89 180 top
R10  19,52 270 bottom
R11  33,94 180 bottom
R12  44,51 0 bottom
R13  40,94 180 bottom
R14  87.4,31.8 90 top
R15  47,94 180 bottom
R16  85.4,31.8 90 top
R17  94.3,88.3 270 bottom
R18  96.4,88.3 270 bottom
RTC1  14,55 180 top
S1:Q1  BSS138  [SOT23]  74.6,46.7 180 bottom
S1:R1  10k  [R0805]  77.2,46.7 90 bottom
S1:R2  10k  [R0805]  72,46.7 270 bottom
S2:Q1  BSS138  [SOT23]  90.1,11.3 90 bottom
S2:R1  10k  [R0805]  90.1,13.9 0 bottom
S2:R2  10k  [R0805]  90.1,8.7 180 bottom
S3:Q1  BSS138  [SOT23]  69.4,77.3 270 bottom
S3:R1  10k  [R0805]  69.4,74.7 180 bottom
S3:R2  10k  [R0805]  69.4,79.9 0 bottom
S4:Q1  BSS138  [SOT23]  73.6,75.9 270 bottom
S4:R1  10k  [R0805]  73.6,73.3 180 bottom
S4:R2  10k  [R0805]  73.6,78.9 0 bottom
S5:Q1  BSS138  [SOT23]  77.9,66.8 180 bottom
S5:R1  10k  [R0805]  80.5,66.8 90 bottom
S5:R2  10k  [R0805]  75.3,66.8 270 bottom
SV1  25.4,47.67 0 top
SW1  14.4,90.2 7.5 top
SW2  25.8,97 5.5 top
SW3  30,89 90 top
SW4  44,89 90 top
SW5  33.2,97.5 3.5 top
SW6  40.5,97.9 2 top
SW7  47.7,98 0 top
TOF_AR  3.1,72 270 top
TOF_ARD  9,22 270 top
TOF_ARG  84,3.5 0 top
TOF_AV  86,77 90 top
U1  91,40.5 0 top

### Tracks (layer width: path | path; a pad name or v marks a point on that pad's centre or on a via)
3V3  (via drill 0.35)
  Top 0.152: EXT_2.4 10.38,22 | TOF_ARD.2 10.38,22 | v8.76,53.65 9.8,52.61 9.8,44.31 v9.55,44.06 9.55,43.17 9.8,42.92 9.8,25.13 10.38,24.56 10.38,22 | v3.1,72 TOF_AR.2 | v84.89,72.36 84.89,76.21 84.1,77 TOF_AV.2 74.85,77 S4:Q1.1 74.57,76.72 74.57,71.77 v74.67,71.67 | TOF_ARG.2 84,4.9 84.7,4.2 v85.5,4.2 | U1.3.3V3 84.78,32.75 R16.2 R14.2 88.88,32.75 v88.93,32.8 | v92.18,32.8 91.93,33.05 91.93,64.82 v92.18,65.07
  Bottom 0.152: v8.76,53.65 5.46,53.65 2.79,56.33 2.79,71.69 v3.1,72 | U1.3.3V 92.26,64.63 92,64.9 | v84.89,72.36 84.89,72 92,64.9 | S4:Q1.1 73.43,75.58 73.43,75.31 72.65,74.53 S4:R1.1 71.5,74.45 71.5,77.25 S3:Q1.1 69.23,76.98 69.23,76.7 68.45,75.93 S3:R1.1 | v74.67,71.67 76.95,69.39 S5:Q1.1 78.22,66.63 78.5,66.63 79.27,65.85 S5:R1.1 80.3,65.85 R7.1 | 88.35,6.55 88.4,6.5 88.4,4.61 87.97,4.17 85.53,4.17 v85.5,4.2 85.5,5.42 EXT_1.4 | 88.35,6.55 88.27,6.63 87.91,6.63 84.95,9.59 84.36,9.59 83.7,10.25 81.5,10.25 81.36,10.39 81.36,34.15 | 81.36,34.15 81.36,42.77 80.12,44 60.13,44 59.63,44.5 58.02,44.5 56.71,43.19 20,43.19 18.92,42.1 15.3,42.1 15.23,42.17 15.23,43.57 14.92,43.88 10.41,43.88 10.34,43.96 9.65,43.96 v9.55,44.06 | 81.36,34.15 U1.3.3V3 83.38,35.34 84.33,36.3 84.33,39.62 83.78,40.18 83.02,40.18 82.27,40.93 82.27,43.15 79.67,45.75 S1:R1.1 75.97,45.75 75.19,46.53 74.92,46.53 S1:Q1.1 | S2:R1.1 91.05,12.67 90.08,11.7 90.08,10.4 | v88.93,32.8 v92.18,32.8 | v92.18,65.07 92.01,64.9 92,64.9 | 88.35,6.55 89.52,7.72 89.89,7.72 90.08,7.9 90.08,10.4 | S2:Q1.1 89.05,10.4 90.08,10.4
  other vias: 74.7,76.85
+5V/1  (via drill 0.35)
  Top 0.152: v9.98,54.87 9.98,53.3 10.41,52.86 10.41,43.88 10.66,43.63 10.66,43.17 10.41,42.92 10.41,32.88 | v13.87,24.8 11,24.8 10.41,25.39 10.41,32.88 | ENC_D.4 10.41,32.88 | 75.2,67.6 75.3,67.7 S5:R2.1 | 70.4,67.6 70.35,67.65 S3:R2.1 | ENC_G.4 89.92,8.7 S2:R2.1 | v85.49,46.39 84.84,45.74 v84.84,44.6 | v85.56,51.53 85.56,62.84 84.9,63.5 | DC2.3 52.64,68.9 52.64,69.79 52.31,70.12 51.85,70.12 51.77,70.04 15.86,70.04 8.59,62.78 v8.24,62.78
  Top 0.508: DC2.3 60.1,68 C6.+ 70.4,67.6 75.2,67.6 78.81,67.6 82.91,63.5 84.9,63.5 91,69.6 | 91,69.6 D2.C 96.08,78.88 DISPLAY.4 | U1.VIN 91.11,69.71 91,69.6
  Bottom 0.152: MOTOR.4 13.94,24.73 v13.87,24.8 | S3:R2.1 73.55,79.9 S4:R2.1 | S1:R2.1 72,48.3 72.43,48.73 79.38,48.73 82.51,45.6 84.2,45.6 84.84,44.95 v84.84,44.6 85.09,44.35 85.09,12.4 88.8,8.7 S2:R2.1 | v85.56,51.53 85.56,46.46 v85.49,46.39 | v9.98,54.87 9.4,55.44 8.58,55.44 8.09,55.93 8.09,62.63 v8.24,62.78
  Bottom 0.508: DC2.3 53.54,70.34 JMP2.3
  other vias: 70.35,79.9 75.3,67.75 89.15,8.7
+5V/2  (via drill 0.35)
  Top 0.8: DC3.3 50.4,57.36 C5.+
  Bottom 0.8: SV1.2 SV1.4 5.11,47.7 47.5,47.7 48.29,48.49 48.29,49.45 50.4,51.56 C5.+
  other vias: 50.4,54.5
+12V  (via drill 0.35)
  Top 0.152: 6.21,35.29 6.21,39 AR-URG-2.TP
  Top 0.508: 48.5,65.7 F2.1 28.7,65.7 HB1:C9.+ | 48.5,65.7 52.7,65.7 57.9,60.5 57.9,42.94 v58,42.84 | HB1:U2.5 28,59.89 | HB1:U2.4 28,59.89 | 28,59.89 28,59.4 | 6.21,35.29 6.21,17.99 6.5,17.7 8,17.7 8.95,16.75 C2.1 9.12,15.82 EXT_2.5 | v6.67,39 AR-URG-2.TP | DC2.1 48.46,65.74 48.5,65.7
  Top 0.8: 28,59.4 27.36,58.77 HB1:U2.12 27.36,53.02 HB1:C8.1
  Top 1.27: HB1:C9.+ 28,65.6 28,63.7 28,59.4 | 3.3,53.5 3.3,51.4
  Top 2.54: 28,63.7 13,63.7 3.4,54.1
  Bottom 0.508: C8.1 49.05,76.59 DC1.1 49.05,75.41 C4.1 49.05,68.59 DC2.1 | CON2.2 4.95,89 C7.1 6.25,88.45 6.66,88.04 6.66,85.73 6.42,85.49 4.79,85.49 2,82.7 v2,54.8 | C3.1 14.05,40.05 CON1.2 12.19,38.09 11.12,38.09 10.21,39 v6.67,39 | v58,42.84 58.07,42.76 79.82,42.76 80.26,42.32 80.26,9.94 81.04,9.16 83.24,9.16 83.95,8.45 C11.1 84.12,7.83 EXT_1.5
  pour Top: 0,35 0,55 6.5,55 6.5,35
AX12_DATA  (via drill 0.35)
  Top 0.152: EXT_2.2 12.88,14.07 15.04,16.23 15.04,33.43 17.35,35.74 17.35,39.25 CON1.1 | v8.2,53 7.92,52.73 7.92,38.48 v8.13,38.27 | v58.63,43.5 58.63,45.6 v58.7,45.67
  Bottom 0.152: CON2.1 4.12,89.48 6.19,89.48 7.14,88.53 7.14,85.53 6.62,85.01 4.99,85.01 2.48,82.5 2.48,56.2 5.68,53 v8.2,53 | v8.13,38.27 10.27,38.27 10.92,37.61 12.39,37.61 13.05,38.27 14.87,38.27 CON1.1 17.67,40 20.26,42.59 56.96,42.59 57.77,43.39 58.63,43.39 | EXT_1.2 87.88,4.97 87.37,4.47 86.23,4.47 86.1,4.61 86.1,7.58 84.69,8.98 84.1,8.98 83.44,9.64 81.24,9.64 80.75,10.14 80.75,42.52 79.87,43.39 58.63,43.39 | S1:Q1.3 74.45,45.75 S1:R2.2 71.17,44.92 60.51,44.92 60.01,45.42 58.95,45.42 v58.7,45.67 | v58.63,43.5 58.63,43.39
AX12_DATA_LV
  Bottom 0.152: U1.10 U1.9 | U1.9 | S1:Q1.2 77.05,47.8 S1:R1.2 80.03,47.65 U1.9
ENC_D_A  (via drill 0.35)
  Top 0.152: ENC_D.2 13.4,30.38 13.81,30.79 13.81,37.72 12.82,38.72 12.82,41.28 13.57,42.03 14.73,42.03 15.23,42.54 15.23,42.89 15.79,43.45 v15.79,43.52
  Bottom 0.152: U1.11 82.53,39.23 81.96,39.8 81.96,43.02 80.37,44.61 60.38,44.61 59.88,45.11 57.77,45.11 56.46,43.8 19.75,43.8 18.66,42.71 16.59,42.71 v15.79,43.52
ENC_D_B  (via drill 0.35)
  Top 0.152: ENC_D.1 13.86,29.12 14.12,29.39 14.12,37.85 13.12,38.84 13.12,41.16 13.7,41.73 14.86,41.73 v15.79,42.66
  Bottom 0.152: U1.12 82.27,36.69 81.66,37.3 81.66,42.9 80.25,44.31 60.26,44.31 59.75,44.81 57.89,44.81 56.58,43.5 19.88,43.5 18.79,42.41 16.04,42.41 v15.79,42.66
ENC_G_A
  Top 0.152: U1.34/A15 98.62,12.64 97.67,11.69 97.67,9.07 95.1,6.5 95.1,6.03 ENC_G.2
ENC_G_B
  Top 0.152: ENC_G.1 98.62,8.24 U1.33/A14
ENC_MOT_A  (via drill 0.35)
  Top 0.152: v14.48,22.8 14.73,23.05 14.73,33.55 15.62,34.45 15.62,41.27 17.1,42.75 v17.1,43.27
  Bottom 0.152: MOTOR.5 15.09,22.19 v14.48,22.8 | v17.1,43.27 18.79,43.27 19.63,44.11 56.33,44.11 62.56,50.34 83.78,50.34 84.33,49.78 84.33,46.33 85.7,44.96 85.7,40.9 86.2,40.4 97.45,40.4 U1.14/A0
ENC_MOT_B  (via drill 0.35)
  Top 0.152: v14.48,20.2 14.48,22.01 13.92,22.57 13.92,23.03 14.43,23.53 14.43,33.68 15.32,34.57 15.32,41.4 16.34,42.43 16.34,43.73 v16.57,43.95
  Bottom 0.152: MOTOR.6 15.03,19.65 v14.48,20.2 | v16.57,43.95 19.04,43.95 19.5,44.41 56.2,44.41 62.44,50.65 83.9,50.65 84.64,49.91 84.64,46.45 86.01,45.08 86.01,41.02 86.33,40.7 97.56,40.7 U1.15/A1
EXT_+5V  (via drill 0.35)
  Top 0.508: JMP1.1 47.83,75 47.98,74.84 52.38,74.84 DC1.3 60.1,76 C9.+ 62.4,77.5 HB2:C9.+ 68.27,91.36 v69,91.36
  Bottom 0.508: 71.52,92 HB2:U2.5 v69,91.36 HB2:U2.12 | 71.52,92 HB2:U2.4 | HB2:C8.1 71.52,92 | DC1.3 53.6,75.94 JMP2.1
EXT_DATA
  Bottom 0.152: S2:Q1.3 91.05,11.15 S2:R2.2 91.05,7.47 EXT_1.1
EXT_DATA_LV
  Bottom 0.152: U1.7 U1.8 85.4,44.83 85.4,17.65 S2:R1.2 89.15,12.4 S2:Q1.2
EXT_VCC  (via drill 0.35)
  Top 0.508: JMP1.2 33,75.8 32.6,76.2 24.4,76.2 v23.6,75.4 | EXT_2.1 15.52,14.89 15.52,33.23 17.83,35.54 17.83,43.1 19.39,44.67 21.6,44.67 23.04,46.1 23.04,53.97 22.75,54.25 22.75,61.9 v22.8,61.95
  Bottom 0.508: v22.8,61.95 22.8,74.6 v23.6,75.4
FLAG_CS  (via drill 0.35)
  Top 0.152: v97.4,63.1 97.4,45.53 U1.16/A2
  Bottom 0.152: HB2:R9.1 HB2:R10.2 79.75,76.71 93.36,63.1 v97.4,63.1
FLAG_GPIO1  (via drill 0.35)
  Top 0.152: U1.31/A12 89.28,19.73 | 89.28,19.73 90.1,20.55 90.1,46.9 88.56,48.44 82.98,48.44 82.4,49.02 82.4,50.11 72.69,59.82 72.69,64.43 73.4,65.14 v73.7,65.14 | C12.1 89.28,19.77 89.28,19.73
  Bottom 0.152: R1.1 65.91,80.25 65.91,73.88 73.7,66.09 v73.7,65.14
FLAG_GPIO2  (via drill 0.35)
  Top 0.152: U1.32/A13 84.4,12.31 84.4,14.42 88.04,18.06 | 88.04,18.06 90.41,20.42 90.41,48.53 88.57,50.37 82.57,50.37 72.99,59.95 72.99,63.58 v73.7,64.29 | C13.1 88.04,18.01 88.04,18.06
  Bottom 0.152: R2.1 65.6,73.75 73.1,66.25 73.1,64.89 v73.7,64.29
FLAG_INA
  Bottom 0.152: HB2:R1.1 76.97,91.12 76.97,89.55 76.67,89.25 76.67,78.93 94.77,60.83 97.34,60.83 U1.22/A8
FLAG_INB
  Bottom 0.152: HB2:R2.1 76.36,81.39 76.36,78.81 94.64,60.53 96.9,60.53 97.4,60.03 97.4,58.23 U1.21/A7
FLAG_PWM
  Bottom 0.152: HB2:R3.1 73.18,82.47 74.85,82.47 76.06,81.26 76.06,78.68 95.13,59.61 95.13,59.16 95.69,58.6 96.5,58.6 97.4,57.7 97.4,55.69 U1.20/A6
FLAG_SEL
  Bottom 0.152: HB2:R4.1 76.97,89.12 76.97,79.06 94.89,61.14 97.67,61.14 U1.23/A9
GND  (via drill 0.35)
  Top 0.8: HB1:U2.8 HB1:U2.9 | HB1:U2.1 HB1:U2.16
  Bottom 0.508: HB2:U2.16 HB2:U2.1 | HB2:U2.9 HB2:U2.8
  other vias: 23.6,58 23.6,59 23.6,57 26.1,58 29.9,58 32.4,58 32.4,59 32.4,57 26,66 24.3,67.8 27.5,67.8 97,85.2 97.3,80.6 96.7,77.8 63.7,66.5 65.8,66.5 57.5,66.6 8.2,37.4 9.2,37.7 9.2,35.8 8.5,39.8 9.2,40.5 8.6,45.1 11,45.1 12.7,45.6 20.3,45.6 20.3,49.7 15.2,49.9 20.3,51.8 15.2,52 27.9,45.3 33,45.3 27.9,49.7 33,49.7 27.9,51.7 33,51.7 14.1,75.1 16.1,75.1 23.6,72.6 57.1,52.6 58.7,52.6 69,96.5 68.1,96.5 69.9,96.5 69,87.5 68.1,87.5 69.9,87.5 74.6,90.6 81.4,82.3 81.1,78.3 12.6,27.1 9,31 14.7,35.9 16.3,35.9 13.1,31.6 93.1,4.1 95.1,15.1 95.1,26.1
  pour Bottom (rank 2): 0,0 100,0 100,100 0,100
  pour Top (rank 2): 0,0 100,0 100,100 0,100
HB1:N$5  (via drill 0.35)
  Bottom 0.152: HB1:U2.11 27.85,55.48 28.41,56.03 30.14,56.03 30.39,55.78 32.65,55.78 36.47,59.6 59.45,59.6 HB1:R3.2
  other vias: 26.09,55.48
HB1:N$6  (via drill 0.35)
  Bottom 0.152: HB1:U2.6 29.12,60.52 29.74,59.91 60.76,59.91 HB1:R2.2
  other vias: 26.09,60.52
HB1:N$7  (via drill 0.35)
  Bottom 0.152: HB1:U2.3 30.22,60.21 59.06,60.21 HB1:R1.2
  other vias: 29.91,60.52
HB1:N$8  (via drill 0.35)
  Bottom 0.152: HB1:U2.14 32.78,55.48 36.59,59.3 57.76,59.3 HB1:R4.2
  other vias: 29.91,55.48
HB1:N$9  (via drill 0.35)
  Bottom 0.152: HB1:U2.13 29.12,55.48 29.68,54.92 30.14,54.92 30.39,55.17 32.9,55.17 36.72,58.99 57.63,58.99 60.07,56.55 60.07,55.26 60.2,55.12 66.27,55.12 HB1:R6.2 HB1:R5.2
  other vias: 28.64,55.48
HB1:N$13
  Bottom 0.152: HB1:R5.1 HB1:C7.2 HB1:R9.2
HB2:N$5
  Bottom 0.152: HB2:U2.11 68.91,90.09 69.5,89.5 72.9,89.5 73.2,89.2 73.2,86.15 HB2:R3.2
HB2:N$6
  Bottom 0.152: HB2:U2.6 72.74,90.09 73.5,89.33 73.5,86.14 HB2:R2.2
HB2:N$7
  Bottom 0.152: HB2:R1.2 79.75,92.25 78.1,93.91 HB2:U2.3
HB2:N$8
  Bottom 0.152: HB2:U2.14 68.61,93.91 69.2,94.5 77.94,94.5 79.46,92.98 80.5,92.98 80.63,92.84 80.63,90.88 HB2:R4.2
HB2:N$9
  Bottom 0.152: HB2:U2.13 68.73,92.64 69.4,93.3 78.27,93.3 78.8,92.77 78.8,88.5 79.3,88 HB2:R6.2 HB2:R5.2
HB2:N$13
  Bottom 0.152: HB2:R5.1 HB2:C7.2 HB2:R9.2
IN_COLOR_A  (via drill 0.35)
  Top 0.152: SW7.4 46.87,97.15 47.3,97.58 48.1,97.58 48.53,97.15 SW7.2 v50.5,93.6 | U1.25 85.16,30.85 R16.1 86.35,31.8 88.9,31.8 89.49,32.39 89.49,46.65 88.31,47.83 82.73,47.83 81.79,48.77 81.79,49.85 72.08,59.57 72.08,63.14 71.34,63.87 71.34,64.73 71.67,65.06 72.53,65.06 v72.54,65.07
  Bottom 0.152: v50.5,93.6 50.5,85.74 51.77,84.47 54.45,84.47 72.8,66.13 72.8,65.32 v72.54,65.07
IN_COLOR_B  (via drill 0.35)
  Top 0.152: SW6.4 39.62,96.95 40.15,97.48 42.99,97.48 SW6.2 43.33,94.57 v43.4,94.5 | U1.26 87.4,30.55 R14.1 89.25,30.85 89.8,31.4 89.8,46.77 88.44,48.13 82.86,48.13 82.09,48.9 82.09,49.98 72.38,59.7 72.38,63.62 v71.9,64.1
  Bottom 0.152: v43.4,94.5 43.4,91.98 51.52,83.86 54.2,83.86 71.68,66.38 71.68,64.71 71.9,64.5 v71.9,64.1
IN_JUMPER  (via drill 0.35)
  Top 0.152: U1.6 81.5,53.81 v81.5,61.2
  Bottom 0.152: R8.2 R7.2 C10.2 81.15,61.55 v81.5,61.2
JUMPER  (via drill 0.35)
  Top 0.152: JUMPER.1 7.54,83.02 52.08,83.02 v52.1,83
  Bottom 0.152: v52.1,83 54.2,83 64.9,72.3 64.9,63.5 66.4,62 74.45,62 R8.1
LED_COLOR_A  (via drill 0.35)
  Top 0.152: U1.35/A16 94.84,16.37 90.71,20.5 90.71,48.66 88.7,50.67 82.7,50.67 73.3,60.07 73.3,63.1 73.62,63.43 v73.7,63.43
  Bottom 0.152: R15.2 47.95,87.86 51.65,84.17 54.33,84.17 71.99,66.51 71.99,64.84 72.31,64.51 72.61,64.51 v73.7,63.43
LED_COLOR_B  (via drill 0.35)
  Top 0.152: U1.36/A17 92.73,18.91 91.01,20.63 91.01,48.79 88.82,50.98 82.82,50.98 73.6,60.2 73.6,62.4 73.76,62.56 v73.85,62.56
  Bottom 0.152: R13.2 51.39,83.56 54.08,83.56 71.34,66.29 71.34,63.87 72.66,62.56 v73.85,62.56
LED_DATA  (via drill 0.35)
  Top 0.152: LEDS.5 6.68,59.5 16.25,69.07 51.78,69.07 52.4,68.46 52.4,67.76 54.46,65.7 75.15,65.7 S5:R2.2
  Bottom 0.152: S5:R2.2 77.75,65.85 S5:Q1.3
  other vias: 75.3,65.85
LED_DATA_LV  (via drill 0.35)
  Top 0.152: v84.5,35.4 v86,35.4 | v96.99,35.4 97.09,35.51 97.09,50.39 v96.84,50.64
  Bottom 0.152: S5:Q1.2 79,67.75 S5:R1.2 80.9,68.15 85.3,68.15 93.9,59.55 93.9,59.5 93.94,59.5 94.21,59.23 94.21,58.78 94.52,58.47 94.52,56.36 96.79,54.09 96.79,52.23 96.29,51.73 96.29,51.27 96.84,50.71 v96.84,50.64 | U1.24 84.5,32.73 v84.5,35.4 | v86,35.4 v96.99,35.4
LED_DEBUG_A  (via drill 0.35)
  Top 0.152: U1.37/A18 92.27,21.45 91.32,22.4 91.32,66.36 v90.99,66.69
  Bottom 0.152: v90.99,66.69 89.39,68.28 89.39,80.93 94.3,85.83 R17.2
LED_DEBUG_B  (via drill 0.35)
  Top 0.152: U1.38/A19 92.43,23.99 91.62,24.8 91.62,67.27 v91.5,67.4
  Bottom 0.152: v91.5,67.4 89.7,69.19 89.7,80.8 94.1,85.2 94.2,85.3 96.25,87.35 R18.2
MOT_CS  (via drill 0.35)
  Top 0.152: v96.84,51.5 95.14,53.2 v95.1,53.2
  Bottom 0.152: HB1:R9.1 HB1:R10.2 80.35,56.15 83.3,53.2 v95.1,53.2 | U1.17/A3 98.62,48.04 97.54,49.12 97.54,50.8 v96.84,51.5
MOT_INA
  Bottom 0.152: HB1:R1.1 65.11,59.84 81.13,59.84 U1.2
MOT_INB
  Bottom 0.152: HB1:R2.1 63.41,59.54 83.37,59.54 U1.3
MOT_PWM
  Bottom 0.152: HB1:R3.1 65.2,58.1 66.33,59.23 78.13,59.23 80.36,57.01 U1.4
MOT_SEL
  Bottom 0.152: HB1:R4.1 63.63,56.1 66.45,58.93 78,58.93 82.46,54.47 U1.5
N$1  (via drill 0.35)
  Top 0.508: SW1.2 22.19,84.1 v47.3,84.1
  Bottom 0.508: v47.3,84.1 47.3,67.53 50.05,64.78 C1.1 50.05,62.09 DC3.1
N$2
  pour Top: 0,21 6.5,21 6.5,11.5 0,11.5
N$3
  Top 0.8: HB1:U2.2 HB1:U2.15 31.18,50.11 30.51,49.45 30.51,45.43 27.99,42.91 20.12,42.91 19.59,42.38 19.59,33.54 MOTOR.1
N$4
  Top 0.8: HB1:U2.7 HB1:U2.10 24.82,49.99 25.37,49.45 25.37,45.88 23.35,43.86 19.73,43.86 18.64,42.77 18.64,35.21 16.32,32.89 16.32,31.81 17.09,31.04 17.17,31.04 MOTOR.2
N$5  (via drill 0.35)
  Top 0.508: FLAG.5 v63.9,96.5
  Bottom 0.508: HB2:U2.2 HB2:U2.15 65.22,95.17 v63.9,96.5
N$6  (via drill 0.35)
  Top 0.508: FLAG.4 63.55,95.3 v63.9,95.3
  Bottom 0.508: HB2:U2.7 HB2:U2.10 65.38,88.83 64.7,89.5 64.7,94.5 v63.9,95.3
N$7  (via drill 0.35)
  Top 0.152: v62.2,94 FLAG.3
  Bottom 0.152: R1.2 67.32,83.95 66.44,84.83 65.4,84.83 63.32,86.91 63.32,92.88 v62.2,94
N$8  (via drill 0.35)
  Top 0.152: v62.2,92.8 63.45,92.8 FLAG.2
  Bottom 0.152: R2.2 65.6,84.2 63.01,86.78 63.01,91.99 v62.2,92.8
N$9  (via drill 0.35)
  Top 0.152: LED1.A 23.54,93.86 v23.5,93.9
  Bottom 0.152: v23.5,93.9 24.95,93.9 R3.1
N$10  (via drill 0.35)
  Top 0.152: v37.9,94.3 38.45,94.85 LED8.A
  Bottom 0.152: R13.1 38.2,94 v37.9,94.3
N$11  (via drill 0.35)
  Top 0.508: v7.4,35.73 7.4,45.9 7.44,45.94 7.44,53.37 9.93,55.85 9.93,58.26 13.62,61.95 v13.72,61.95
  Bottom 0.508: v13.72,61.95 14.94,63.17 SW1.C | AR-URG-1.TP 2.5,30.83 v7.4,35.73
  pour Top (no thermals): 0,34 6.5,34 6.5,22 0,22
N$12
  Top 0.508: D2.A 91,79.8 94.2,83 JP1.2
N$13
  Bottom 0.152: SV1.3 5.17,50.3 6.71,50.3 11.46,55.04 RTC1.SDA
N$14
  Bottom 0.152: SV1.5 6.35,49.5 13.12,56.27 RTC1.SCL
N$15
  Top 0.508: F2.2 31.3,74 JMP1.3
N$16
  Top 0.152: LED2.A R5.1
N$17
  Top 0.152: LED3.A R9.1
N$18  (via drill 0.35)
  Top 0.152: v30.7,94.2 30.91,94.41 LED4.A
  Bottom 0.152: R11.1 30.9,94 v30.7,94.2
N$19  (via drill 0.35)
  Top 0.152: v44.9,94.5 45.4,95 LED7.A
  Bottom 0.152: R15.1 45.4,94 v44.9,94.5
N$20
  Bottom 0.152: R18.1 96.67,89.52 LED5.A
N$21
  Bottom 0.152: R17.1 96.43,91.38 LED6.A
N$22  (via drill 0.35)
  Top 0.508: v52.08,69.56 v52.07,69.56 16.05,69.56 8.5,62 LEDS.3 LEDS.4
  Bottom 0.508: JMP2.2 53.33,72.1 52.08,70.86 v52.08,69.56
RPI_3V3  (via drill 0.35)
  Top 0.152: v10.63,55.43 10.63,53.08 10.72,52.99 10.72,51.45 v10.97,51.2
  Bottom 0.152: SV1.1 2.94,50.6 6.59,50.6 10.63,54.64 v10.63,55.43 9.78,56.27 RTC1.VIN | R12.2 43,51.05 R4.2 R10.2 R6.2 11.12,51.05 v10.97,51.2
RPI_IN_MATCH  (via drill 0.35)
  Top 0.152: SW5.4 32.28,96.48 32.89,97.09 35.78,97.09 SW5.2 36.9,95.97 v36.9,95 | SV1.37 40.7,55.23 40.7,64.3 v41.3,64.9
  Bottom 0.152: SV1.37 44.95,50.98 R12.1 | v41.3,64.9 40.7,65.5 40.7,81.53 36.9,85.33 v36.9,95
RPI_IN_NET1  (via drill 0.35)
  Top 0.152: SV1.11 13.97,52.92 R6.1 | SW3.3 SW3.4
  Bottom 0.152: R6.1 14,55.1 14.83,55.93 14.83,62.37 15.43,62.97 15.43,79.87 22.31,86.75 SW3.3
  other vias: 14,52.95 25.45,86.75
RPI_IN_NET2  (via drill 0.35)
  Top 0.152: SV1.15 19,48.98 R10.1 | SW4.4 SW4.3 37.28,84.58 25.15,84.58 v24.9,84.83
  Bottom 0.152: R10.1 18.55,52.95 18,53.5 18,58.01 22.32,62.32 22.32,82.25 v24.9,84.83
  other vias: 19,52.95
RPI_IN_PWDN  (via drill 0.35)
  Top 0.152: SV1.29 36.8,48.97 R4.1 39.79,55.94 39.79,63.33 39.24,63.87 39.24,64.33 39.39,64.48 v39.39,64.91 | SW2.4 24.83,95.89 25.53,96.59 26.79,96.59 26.8,96.6 28.49,96.6 SW2.2 30.1,94.99 v30.1,92.9
  Bottom 0.152: v39.39,64.91 40.09,65.61 40.09,81.27 36.29,85.08 36.29,91.68 35.07,92.9 v30.1,92.9
  other vias: 36.8,52.95
RPI_LED_MATCH  (via drill 0.35)
  Top 0.152: SV1.33 41.91,53.58 40.4,55.1 v40.4,64.89 v40.4,64.9
  Bottom 0.152: v40.4,64.9 40.4,81.4 36.59,85.2 36.59,91.81 34.4,94 R11.2
RPI_LED_NET1  (via drill 0.35)
  Top 0.152: SV1.13 16.8,49.23 v16.8,52.9 | R5.2 35.95,85.64 35.5,85.19 25.76,85.19 25.26,85.69 23.96,85.69 v23.1,84.83
  Bottom 0.152: v16.8,52.9 17.39,53.49 17.39,58.26 21.71,62.57 21.71,83.44 v23.1,84.83
RPI_LED_NET2  (via drill 0.35)
  Top 0.152: SV1.16 17.7,47.74 v17.7,52.9 | R9.2 38.05,85.78 37.16,84.89 25.63,84.89 25.13,85.39 24.67,85.39 24.11,84.83 v24,84.83
  Bottom 0.152: v17.7,52.9 17.7,58.13 22.01,62.44 22.01,82.85 v24,84.83
RPI_LED_PWR  (via drill 0.35)
  Top 0.152: SV1.31 40.09,49.66 40.09,63.81 v39.8,64.1
  Bottom 0.152: v39.8,64.1 39.55,64.35 39.16,64.35 38.84,64.68 38.84,65.14 39.79,66.09 39.79,81.15 35.99,84.95 35.99,91.55 35.19,92.34 28.61,92.34 R3.2
SCL  (via drill 0.35)
  Top 0.152: DISPLAY.1 97.17,75.12 v96.5,75.8 | v91.02,80.86 90.72,81.16 74.91,81.16 S4:R2.2
  Bottom 0.152: S4:Q1.3 72.65,76.05 S4:R2.2 | v96.5,75.8 91.44,80.86 v91.02,80.86
  other vias: 72.65,78.9
SCL_LV
  Bottom 0.152: U1.19/A5 97.4,53.15 97.4,54.34 95.13,56.62 95.13,58.72 94.82,59.03 94.82,59.48 85.55,68.76 82.98,68.76 79.12,72.63 75.22,72.63 S4:R1.2 74.55,74.8 S4:Q1.2
SDA  (via drill 0.35)
  Top 0.152: DISPLAY.2 96.83,76.38 v96.5,76.7 | v91.63,81.47 70.02,81.47 S3:R2.2
  Bottom 0.152: S3:Q1.3 68.45,77.45 S3:R2.2 | v96.5,76.7 91.73,81.47 v91.63,81.47
  other vias: 68.45,79.9
SDA_LV
  Bottom 0.152: U1.18/A4 98.5,49.51 98.5,50.7 97.4,51.8 97.4,52.72 97.09,53.02 97.09,54.22 94.82,56.49 94.82,58.6 94.52,58.9 94.52,59.36 85.42,68.45 83.5,68.45 83.4,68.45 82.86,68.45 78.99,72.32 71.91,72.32 70.35,73.88 S3:R1.2 70.5,74.85 S3:Q1.2
TOF_DATA  (via drill 0.35)
  Top 0.152: EXT_2.3 11.62,18.43 12.6,19.4 12.6,23 12.35,23.25 TOF_ARD.3 11.5,23.87 10.11,25.26 v10.11,43.4 10.11,52.73 9.37,53.48 v9.37,54.26 | v3.34,70.7 3.39,70.75 TOF_AR.3 | U1.1 U1.0 83.38,68.36 84.33,69.31 84.33,74.92 TOF_AV.3 | TOF_ARG.3 82.75,6.75 83.1,7.1 v86.65,7.1 | v59.4,43.95 59.4,48.39 v59.55,48.55 | v84.7,51.53 v84.7,62.77
  Bottom 0.152: v9.37,54.26 5.29,54.26 3.09,56.45 3.09,70.45 v3.34,70.7 | EXT_1.3 86.4,5.77 86.4,7.1 | 86.4,7.1 86.4,7.7 84.82,9.28 84.23,9.28 83.57,9.94 81.37,9.94 81.05,10.26 81.05,42.64 80,43.7 59.65,43.7 v59.4,43.95 59.29,44.05 58,44.05 56.84,42.89 20.13,42.89 19.04,41.8 15.1,41.8 14.93,41.97 14.93,43.45 14.79,43.58 11.4,43.58 11.23,43.4 v10.11,43.4 | v86.65,7.1 86.41,7.1 86.4,7.1 | v59.55,48.55 61.96,50.95 84.12,50.95 v84.7,51.53 | v84.7,62.77 84.7,63.31 U1.1
V_LIPO
  pour Top: 0,10.5 6.5,10.5 6.5,0 0,0
VUSB
  Bottom 0.508: JP1.1 98.27,70.96 97.49,70.18 97.49,68.58 U1.VUSB

### Text on the board
tPlace: +12V | EXT_VCC | EXT_5V | AR_URG
bPlace: EXT_5V | LEDS | 5V